# Altium project RP2040 _4 Layer_TEX(21052025).PrjPcb (part 1 of 2)
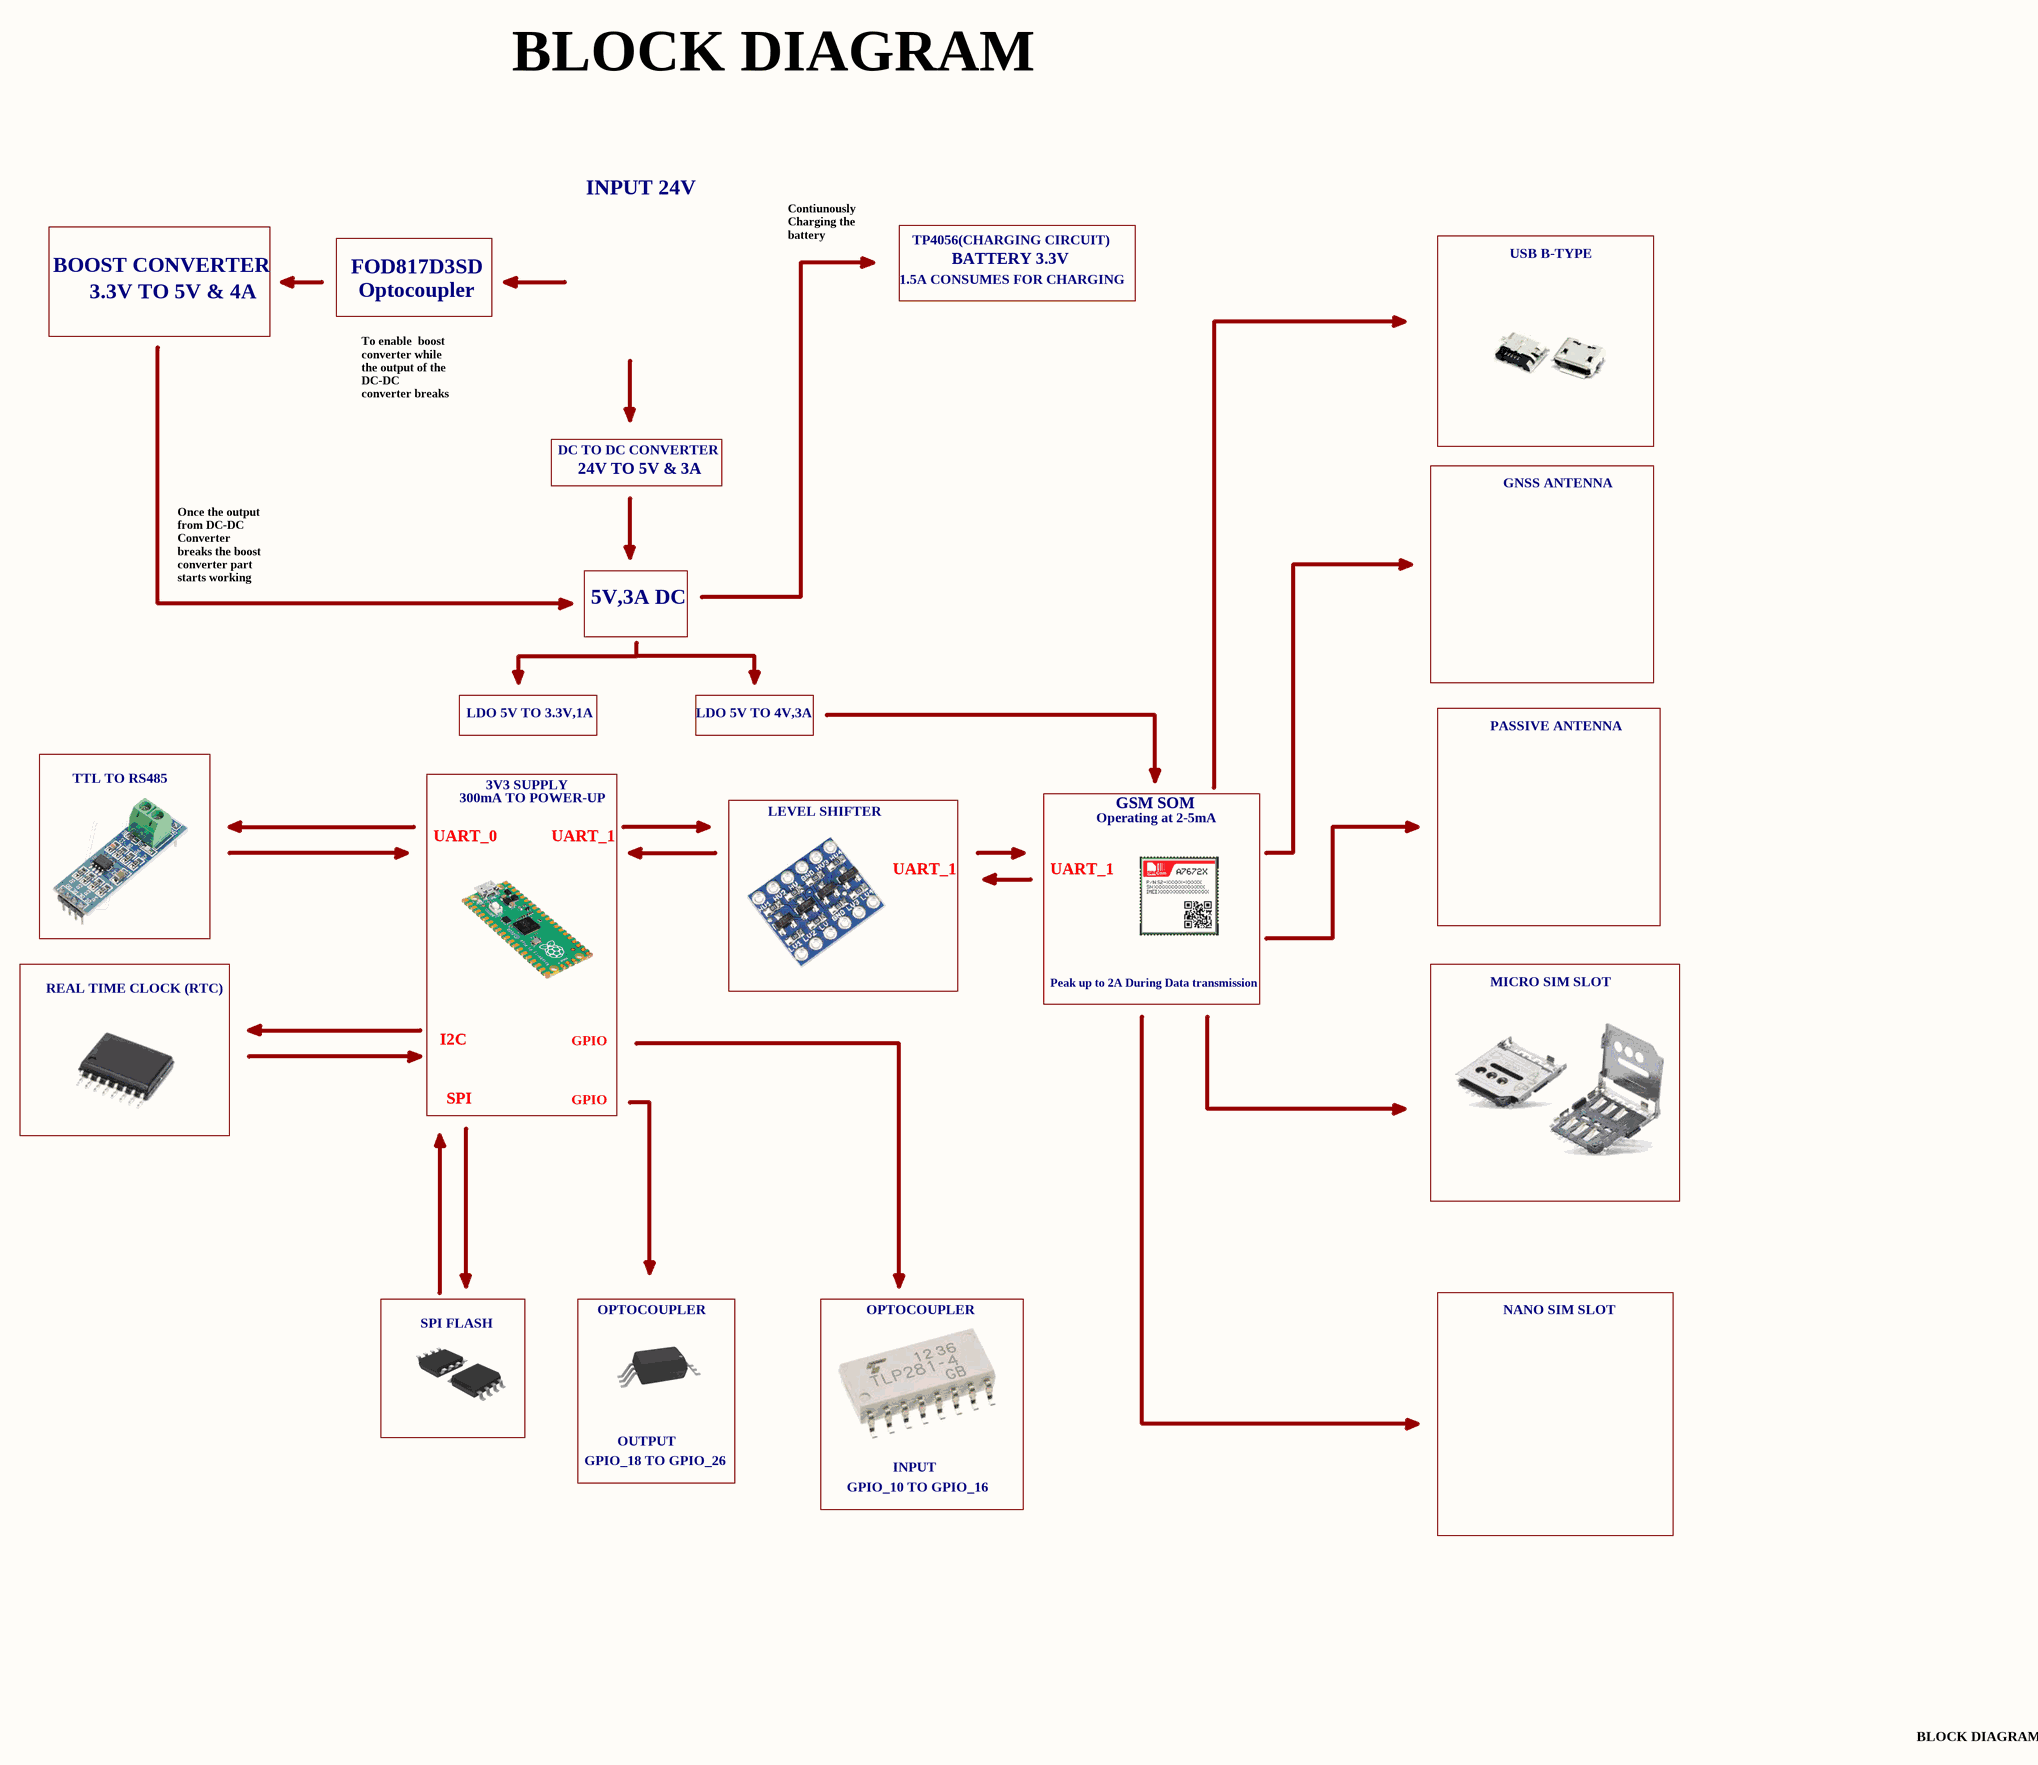
[diagram p0: Block.SchDoc]
7 sheets, 216 parts. Net scope: hierarchical (ports join the sheet entries above them; power ports are global).
Board file: RP2040_GSM.PcbDoc
Sheets:
  Block.SchDoc
  GSM Module.SchDoc
  BLOCK DIAGRAM.SchDoc
    Designator = Raspberry PI.SchDoc
    Designator = Optocoupler.SchDoc
    Designator = Power circuit.SchDoc
    Designator = GSM_SOM.SchDoc

## Sheet Block.SchDoc
size A2; SheetNumber: 1; SheetTotal: 7

### Notes on the sheet
- BLOCK DIAGRAM
- INPUT 24V
- Contiunously Charging the battery
- TP4056(CHARGING CIRCUIT)
- USB B-TYPE
- BOOST CONVERTER
- 3.3V TO 5V & 4A
- FOD817D3SD
- Optocoupler
- 1.5A CONSUMES FOR CHARGING
- BATTERY 3.3V
- To enable  boost converter while the output of the DC-DC converter breaks
- DC TO DC CONVERTER
- 24V TO 5V & 3A
- GNSS ANTENNA
- Once the output from DC-DC Converter breaks the boost converter part starts working
- 5V,3A DC
- LDO 5V TO 3.3V,1A
- LDO 5V TO 4V,3A
- TTL TO RS485
- PASSIVE ANTENNA
- UART_0
- 300mA TO POWER-UP
- 3V3 SUPPLY
- UART_1
- LEVEL SHIFTER
- Operating at 2-5mA
- GSM SOM
- Peak up to 2A During Data transmission
- MICRO SIM SLOT
- REAL TIME CLOCK (RTC)
- I2C
- GPIO
- SPI
- SPI FLASH
- OPTOCOUPLER
- NANO SIM SLOT
- GPIO_18 TO GPIO_26
- OUTPUT
- GPIO_10 TO GPIO_16
- INPUT

## Sheet GSM Module.SchDoc
size A3; SheetNumber: 2; SheetTotal: 6
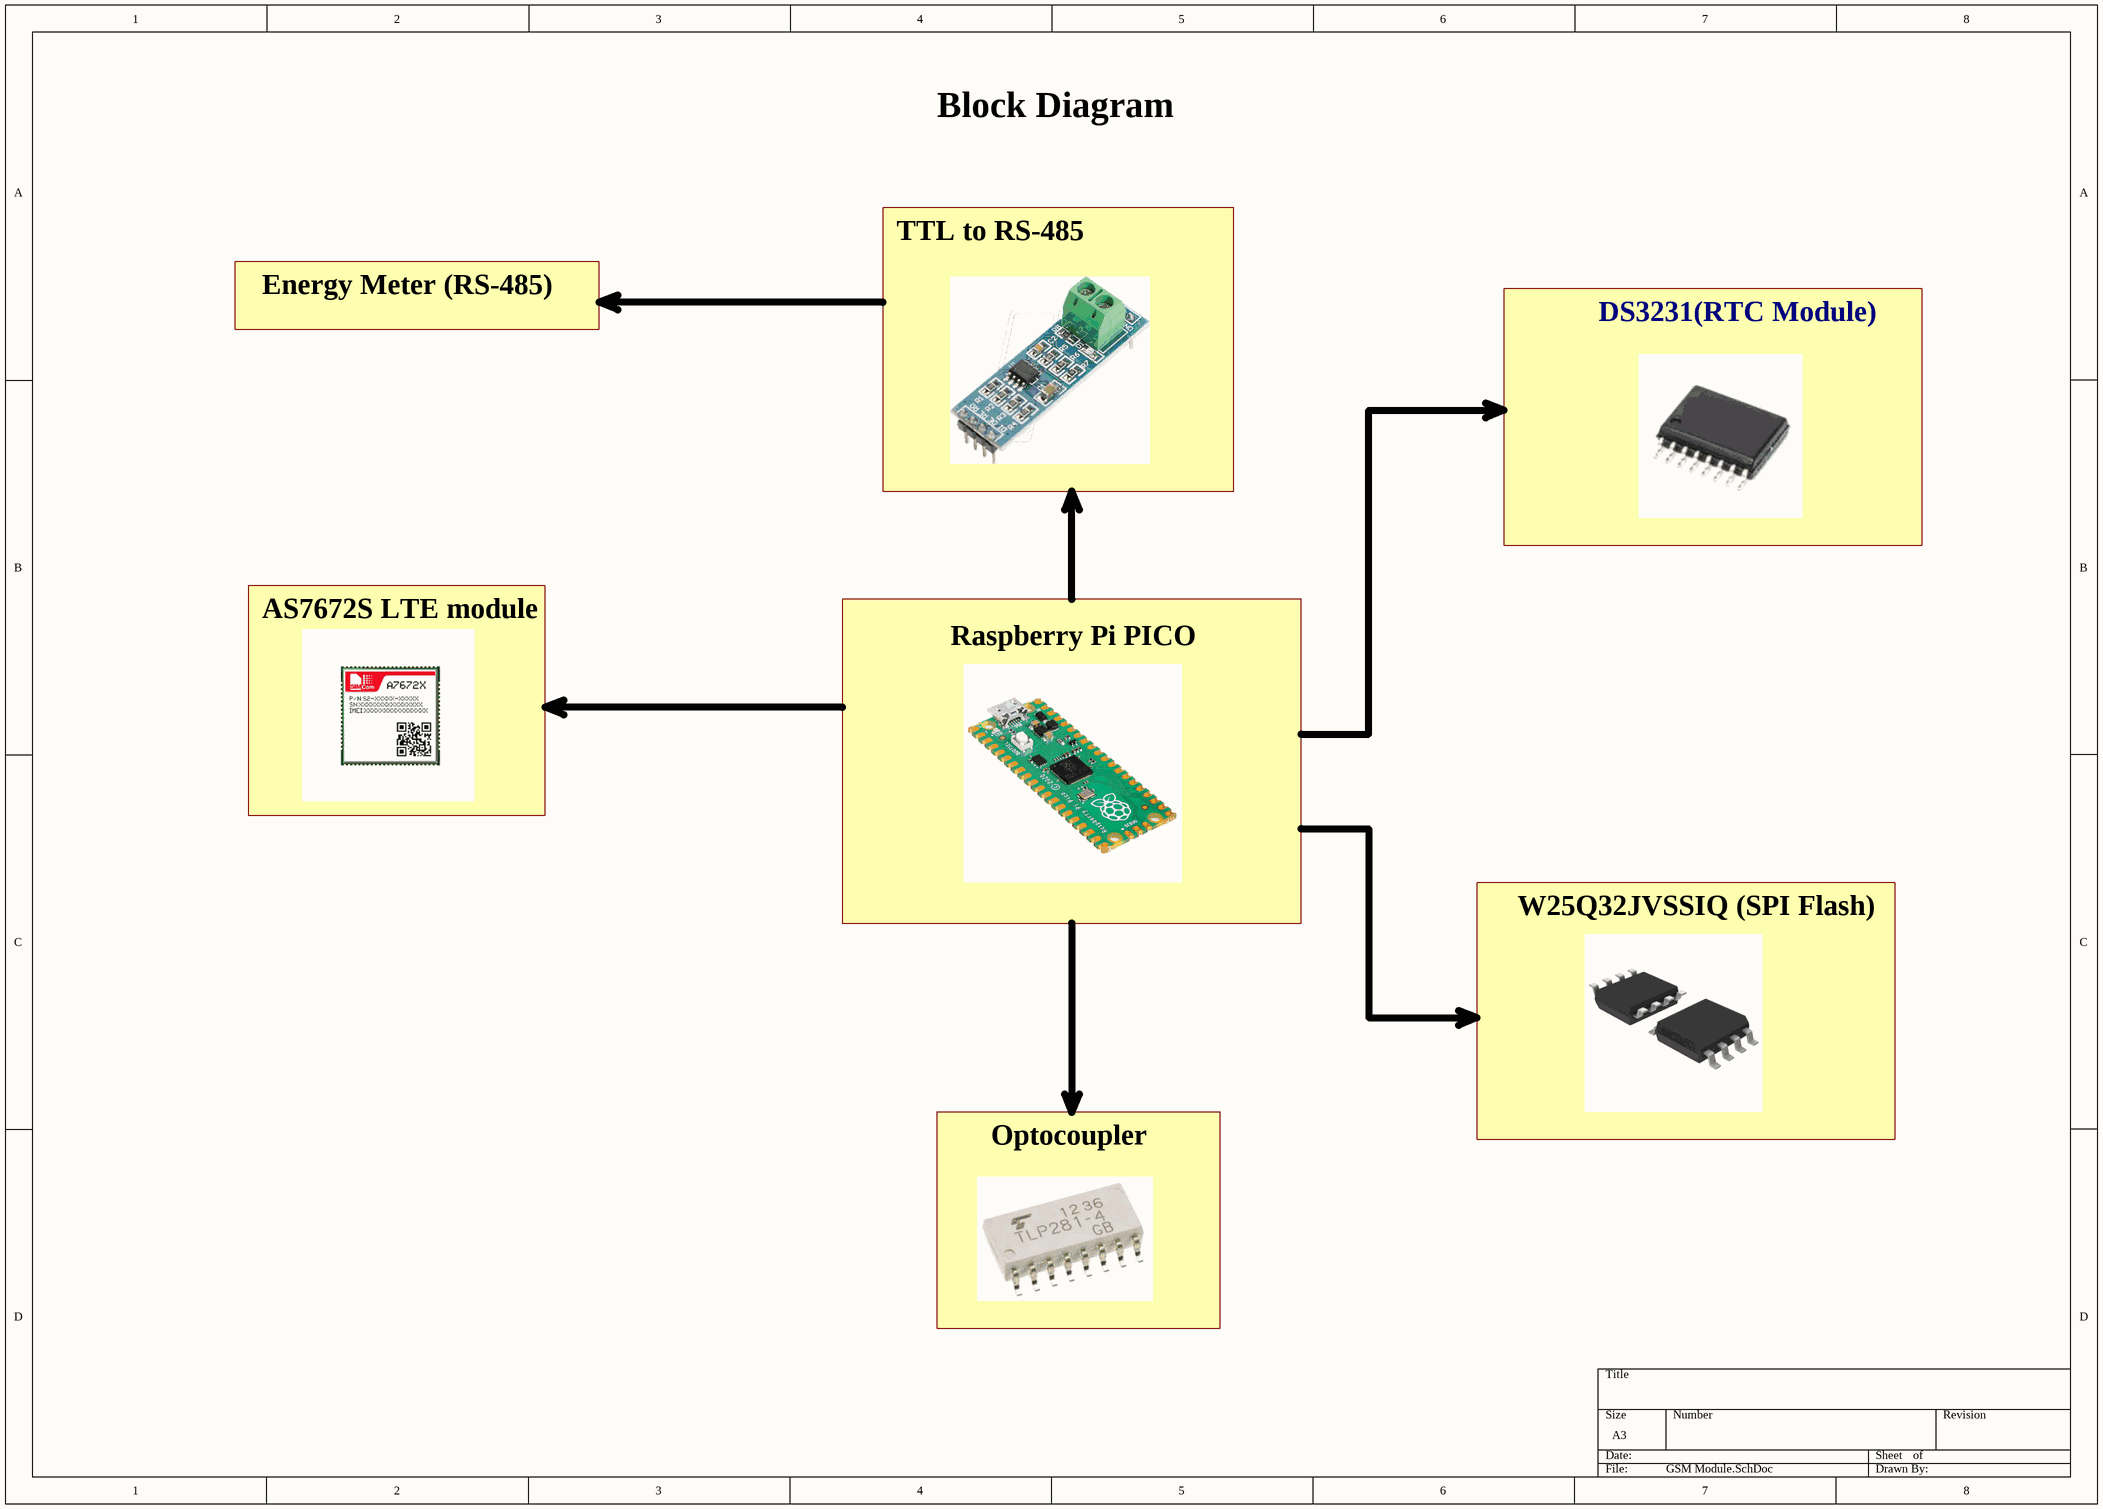
[diagram p1: GSM Module.SchDoc]

### Notes on the sheet
- Block Diagram
- TTL to RS-485
- Energy Meter (RS-485)
- DS3231(RTC Module)
- AS7672S LTE module
- Raspberry Pi PICO
- W25Q32JVSSIQ (SPI Flash)
- Optocoupler

## Sheet BLOCK DIAGRAM.SchDoc
size A3; SheetNumber: 2; SheetTotal: 6
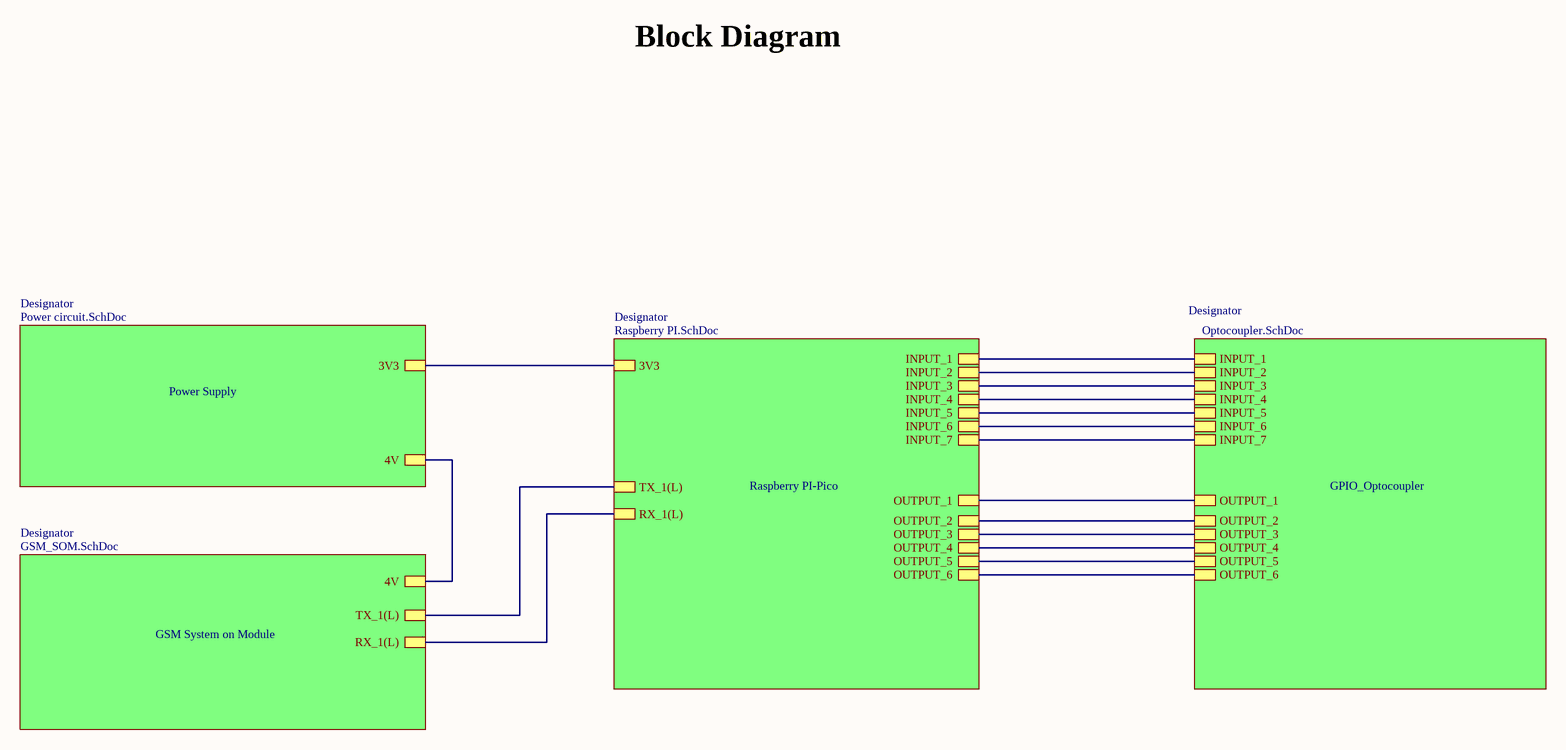
[diagram p2: BLOCK DIAGRAM.SchDoc]

### Sub-sheets
Designator = Raspberry PI.SchDoc: 3V3, INPUT_1, INPUT_2, INPUT_3, INPUT_4, INPUT_5, INPUT_6, INPUT_7, OUTPUT_1, OUTPUT_2, OUTPUT_3, OUTPUT_4, OUTPUT_5, OUTPUT_6, TX_1(L), RX_1(L)
Designator = Optocoupler.SchDoc: INPUT_1, INPUT_2, INPUT_3, INPUT_4, INPUT_5, INPUT_6, INPUT_7, OUTPUT_1, OUTPUT_2, OUTPUT_3, OUTPUT_4, OUTPUT_5, OUTPUT_6
Designator = Power circuit.SchDoc: 3V3, 4V
Designator = GSM_SOM.SchDoc: 4V, TX_1(L), RX_1(L)

### Nets
3V3: sheet Designator/3V3, sheet Designator/3V3
4V: sheet Designator/4V, sheet Designator/4V
RX_1(L): sheet Designator/RX_1(L), sheet Designator/RX_1(L)
TX_1(L): sheet Designator/TX_1(L), sheet Designator/TX_1(L)
NetQ6_10: sheet Designator/INPUT_4, sheet Designator/INPUT_4
NetQ6_12: sheet Designator/INPUT_3, sheet Designator/INPUT_3
NetQ6_14: sheet Designator/INPUT_2, sheet Designator/INPUT_2
NetQ6_16: sheet Designator/INPUT_1, sheet Designator/INPUT_1
NetQ8_12: sheet Designator/INPUT_7, sheet Designator/INPUT_7
NetQ8_14: sheet Designator/INPUT_6, sheet Designator/INPUT_6
NetQ8_16: sheet Designator/INPUT_5, sheet Designator/INPUT_5
NetR36_1: sheet Designator/OUTPUT_1, sheet Designator/OUTPUT_1
NetR39_1: sheet Designator/OUTPUT_2, sheet Designator/OUTPUT_2
NetR40_1: sheet Designator/OUTPUT_3, sheet Designator/OUTPUT_3
NetR41_1: sheet Designator/OUTPUT_4, sheet Designator/OUTPUT_4
NetR42_1: sheet Designator/OUTPUT_5, sheet Designator/OUTPUT_5
NetR45_1: sheet Designator/OUTPUT_6, sheet Designator/OUTPUT_6

### Notes on the sheet
- Block Diagram
- Power Supply
- Raspberry PI-Pico
- GPIO_Optocoupler
- GSM System on Module

## Sheet Raspberry PI.SchDoc
size A3; SheetNumber: 5; SheetTotal: 7
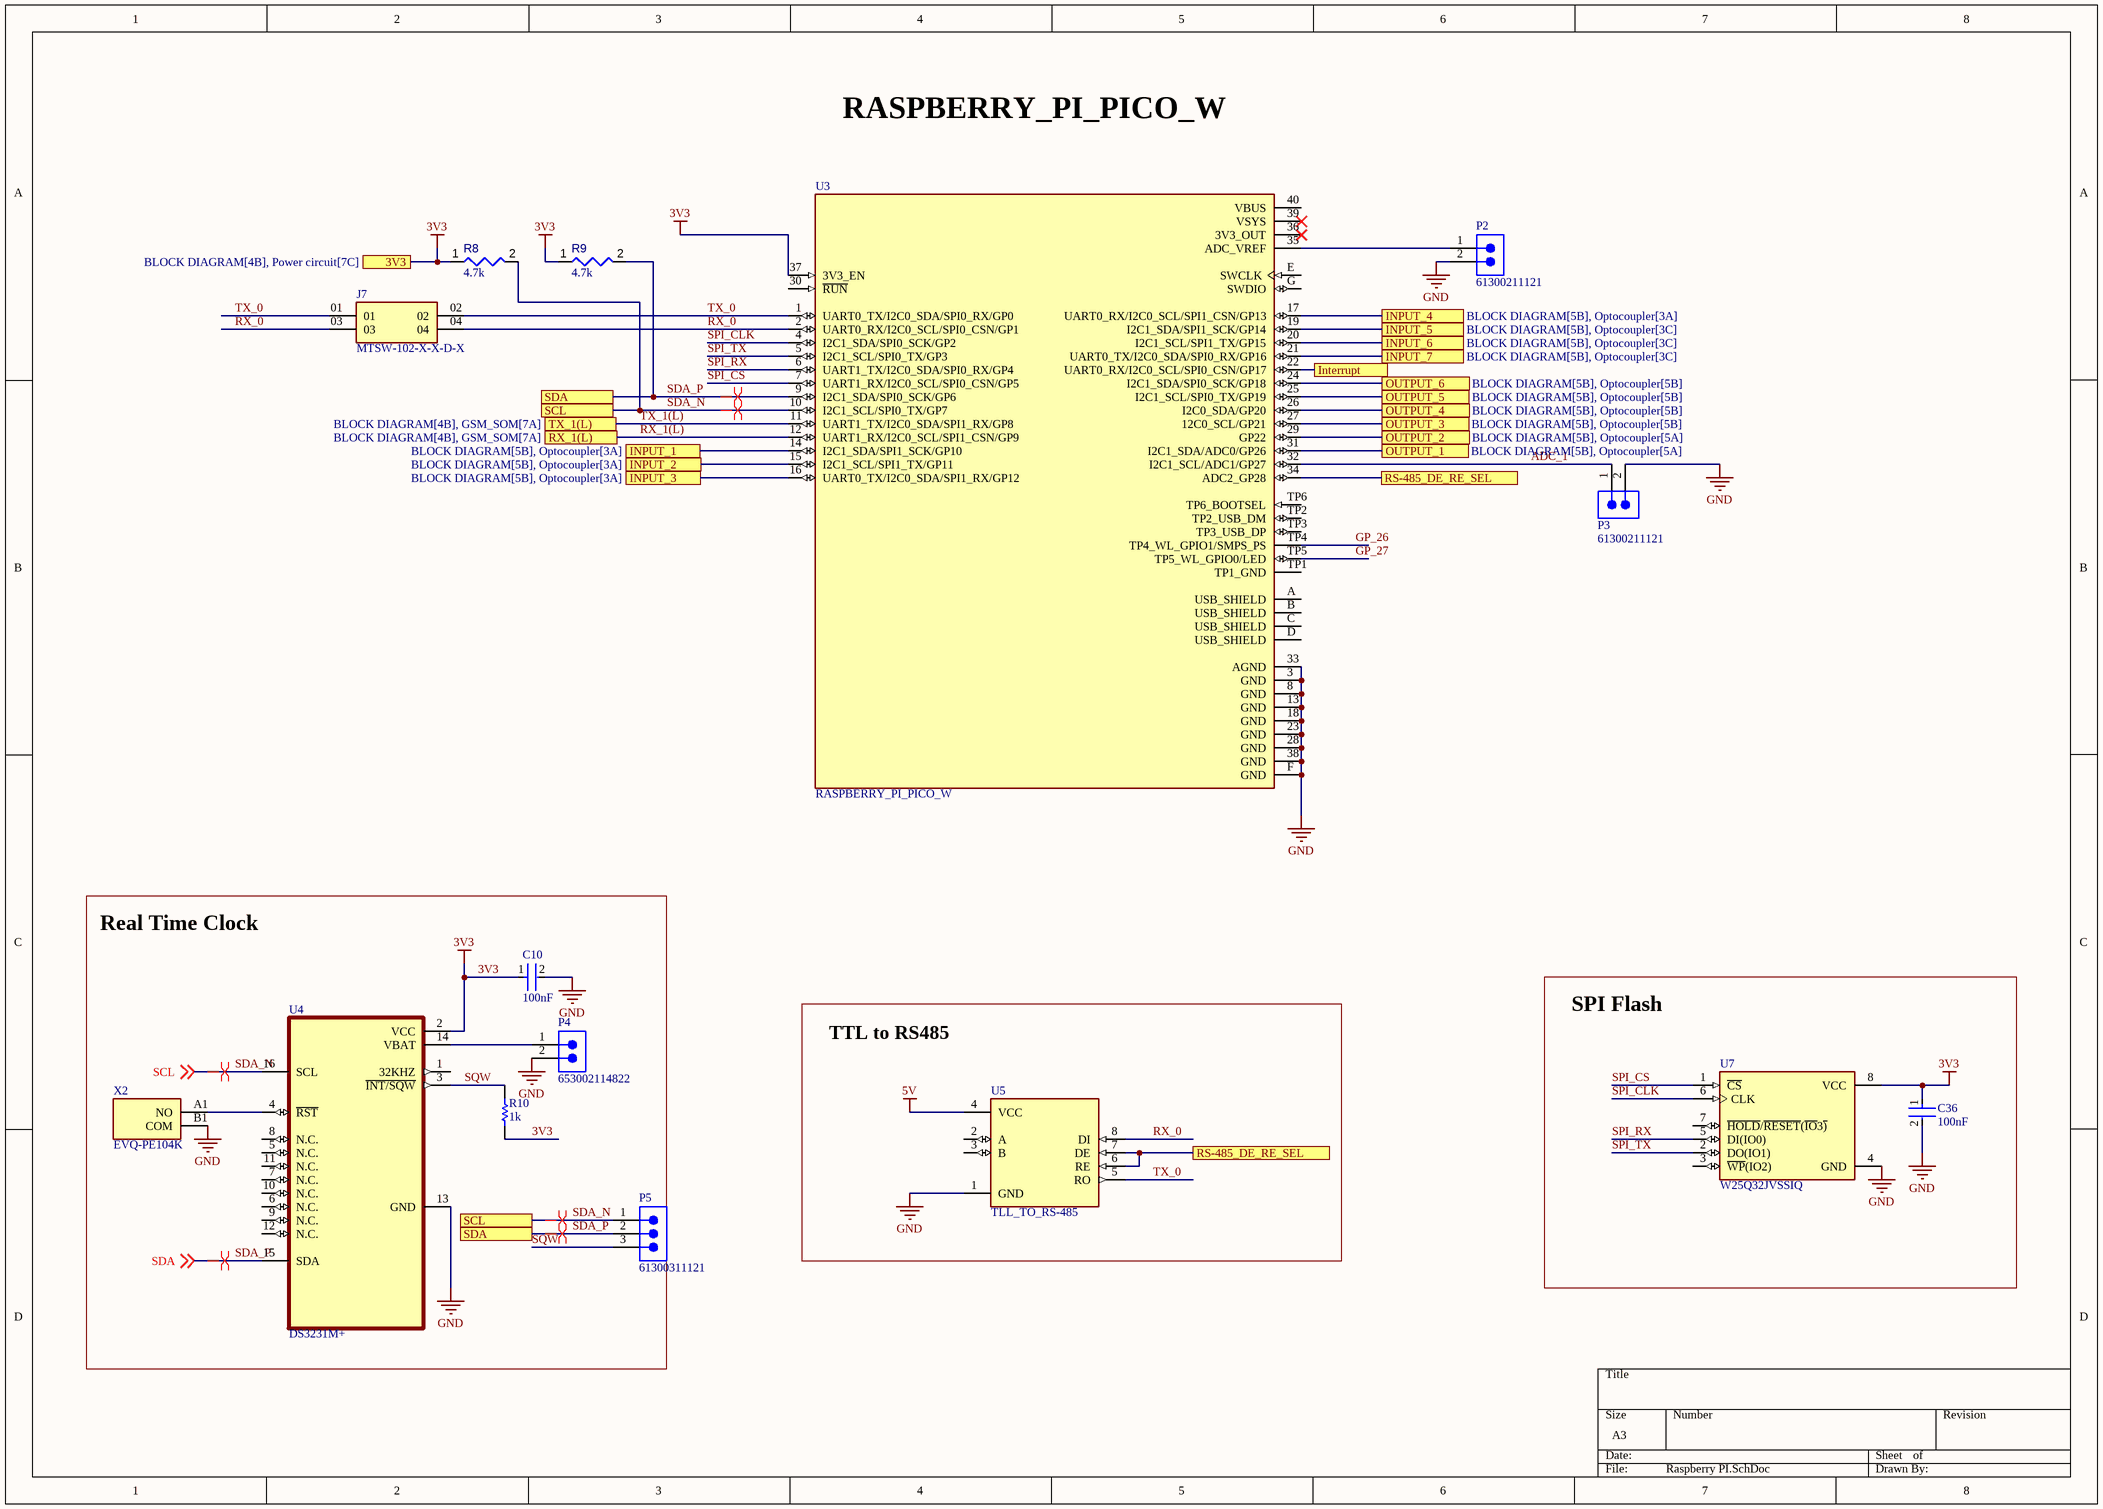
[diagram p3: Raspberry PI.SchDoc]

### Parts
C10  100nF  [FP-C0402-BB-MFG]
C36  100nF  [FP-C0402-BB-MFG]
J7  MTSW-102-X-X-D-X  [SAMTEC_MTSW-102-X-X-D-X]
P2  61300211121  [61300211121]
P3  61300211121  [61300211121]
P4  653002114822  [653002114822]
P5  61300311121  [61300311121]
R8  value 4.7k  [RESC1005X40X25ML05T05]  (hidden comment: Resistor 4k7 +/-1% 0402 100 mW)
R9  value 4.7k  [RESC1005X40X25ML05T05]  (hidden comment: Resistor 4k7 +/-1% 0402 100 mW)
R10  value 1k  [RESC1005X40X25ML05T05]  (hidden comment: Resistor 1k +/-1% 0402 100 mW)
U3  RASPBERRY_PI_PICO_W  [MODULE_RASPBERRY_PI_PICO_W]
U4  DS3231M+  [SOIC127P1032X265-16N]
U5  TLL_TO_RS-485  [MODULE_MAX485_MODULE_5V_LOGIC_TLL_TO_RS-485_CONVERTER]
U7  W25Q32JVSSIQ  [SOIC127P790X216-8N]
X2  EVQ-PE104K  [EVQPE104K]

### Blocks framed on the sheet
Real Time Clock: C10 P4 P5 R10 U4 X2
SPI Flash: C36 U7
TTL to RS485: U5

### Ports
3V3 (see BLOCK DIAGRAM[4B], Power circuit[7C]), INPUT_1 (see BLOCK DIAGRAM[5B], Optocoupler[3A]), INPUT_2 (see BLOCK DIAGRAM[5B], Optocoupler[3A]), INPUT_3 (see BLOCK DIAGRAM[5B], Optocoupler[3A]), INPUT_4 (see BLOCK DIAGRAM[5B], Optocoupler[3A]), INPUT_5 (see BLOCK DIAGRAM[5B], Optocoupler[3C]), INPUT_6 (see BLOCK DIAGRAM[5B], Optocoupler[3C]), INPUT_7 (see BLOCK DIAGRAM[5B], Optocoupler[3C]), Interrupt, OUTPUT_1 (see BLOCK DIAGRAM[5B], Optocoupler[5A]), OUTPUT_2 (see BLOCK DIAGRAM[5B], Optocoupler[5A]), OUTPUT_3 (see BLOCK DIAGRAM[5B], Optocoupler[5B]), OUTPUT_4 (see BLOCK DIAGRAM[5B], Optocoupler[5B]), OUTPUT_5 (see BLOCK DIAGRAM[5B], Optocoupler[5B]), OUTPUT_6 (see BLOCK DIAGRAM[5B], Optocoupler[5B]), RS-485_DE_RE_SEL, RX_1(L) (see BLOCK DIAGRAM[4B], GSM_SOM[7A]), SCL, SDA, TX_1(L) (see BLOCK DIAGRAM[4B], GSM_SOM[7A])

### Nets
3V3: C10.1 C36.1 R8.1 R9.1 R10.2 U3.37(3V3_EN) U4.2(VCC) U7.8(VCC) ; port 3V3
5V: U5.4(VCC)
GND: C10.2 C36.2 P2.2 P3.2 P4.2 U3.3(GND) U3.8(GND) U3.13(GND) U3.18(GND) U3.23(GND) U3.28(GND) U3.33(AGND) U3.38(GND) U3.F(GND) U4.13(GND) U5.1(GND) U7.4(GND) X2.B1(COM)
ADC_1: P3.1 U3.32(I2C1_SCL/ADC1/GP27)  [project net ADC_1_5]
GP_26: U3.TP4(TP4_WL_GPIO1/SMPS_PS)  [project net GP_26_5]
GP_27: U3.TP5(TP5_WL_GPIO0/LED)  [project net GP_27_5]
RX_0: J7.03 J7.04 U3.2(UART0_RX/I2C0_SCL/SPI0_CSN/GP1) U5.8(DI)  [project net RX_0_5]
RX_1(L): U3.12(UART1_RX/I2C0_SCL/SPI1_CSN/GP9) ; port RX_1(L)
SDA_N: P5.1 R8.2 U3.10(I2C1_SCL/SPI0_TX/GP7) U4.16(SCL) ; off-sheet SCL, port SCL  [also labelled SCL]
SDA_P: P5.2 R9.2 U3.9(I2C1_SDA/SPI0_SCK/GP6) U4.15(SDA) ; off-sheet SDA, port SDA  [also labelled SDA]
SPI_CLK: U3.4(I2C1_SDA/SPI0_SCK/GP2) U7.6(CLK)  [project net SPI_CLK_5]
SPI_CS: U3.7(UART1_RX/I2C0_SCL/SPI0_CSN/GP5) U7.1(~{CS})  [project net SPI_CS_5]
SPI_RX: U3.6(UART1_TX/I2C0_SDA/SPI0_RX/GP4) U7.5(DI(IO0))  [project net SPI_RX_5]
SPI_TX: U3.5(I2C1_SCL/SPI0_TX/GP3) U7.2(DO(IO1))  [project net SPI_TX_5]
SQW: P5.3 R10.1 U4.3(~{INT/SQW})  [project net SQW_5]
TX_0: J7.01 J7.02 U3.1(UART0_TX/I2C0_SDA/SPI0_RX/GP0) U5.5(RO)  [project net TX_0_5]
TX_1(L): U3.11(UART1_TX/I2C0_SDA/SPI1_RX/GP8) ; port TX_1(L)
NetP2_1: P2.1 U3.35(ADC_VREF)
NetP4_1: P4.1 U4.14(VBAT)
NetQ6_10: U3.17(UART0_RX/I2C0_SCL/SPI1_CSN/GP13) ; port INPUT_4
NetQ6_12: U3.16(UART0_TX/I2C0_SDA/SPI1_RX/GP12) ; port INPUT_3
NetQ6_14: U3.15(I2C1_SCL/SPI1_TX/GP11) ; port INPUT_2
NetQ6_16: U3.14(I2C1_SDA/SPI1_SCK/GP10) ; port INPUT_1
NetQ8_12: U3.21(UART0_TX/I2C0_SDA/SPI0_RX/GP16) ; port INPUT_7
NetQ8_14: U3.20(I2C1_SCL/SPI1_TX/GP15) ; port INPUT_6
NetQ8_16: U3.19(I2C1_SDA/SPI1_SCK/GP14) ; port INPUT_5
NetR36_1: U3.31(I2C1_SDA/ADC0/GP26) ; port OUTPUT_1
NetR39_1: U3.29(GP22) ; port OUTPUT_2
NetR40_1: U3.27(12C0_SCL/GP21) ; port OUTPUT_3
NetR41_1: U3.26(I2C0_SDA/GP20) ; port OUTPUT_4
NetR42_1: U3.25(I2C1_SCL/SPI0_TX/GP19) ; port OUTPUT_5
NetR45_1: U3.24(I2C1_SDA/SPI0_SCK/GP18) ; port OUTPUT_6
NetU3_22: U3.22(UART0_RX/I2C0_SCL/SPI0_CSN/GP17) ; port Interrupt
NetU3_34: U3.34(ADC2_GP28) U5.6(RE) U5.7(DE) ; port RS-485_DE_RE_SEL
NetU4_4: U4.4(~{RST}) X2.A1(NO)

Not connected (* = marked no-connect by the designer): U3 30(~{RUN}) 36(3V3_OUT)* 39(VSYS)* 40(VBUS) A(USB_SHIELD) B(USB_SHIELD) C(USB_SHIELD) D(USB_SHIELD) E(SWCLK) G(SWDIO) TP1(TP1_GND) TP2(TP2_USB_DM) TP3(TP3_USB_DP) TP6(TP6_BOOTSEL); U4 1(32KHZ) 5(N.C.) 6(N.C.) 7(N.C.) 8(N.C.) 9(N.C.) 10(N.C.) 11(N.C.) 12(N.C.); U5 2(A) 3(B); U7 3(~{WP}(IO2)) 7(~{HOLD}/~{RESET}(~{IO}3~{)})

### Layout directives
differential pair: SDA_N, SDA_P

### Notes on the sheet
- RASPBERRY_PI_PICO_W

### Library data of the parts
C10 C36 = CMP-2008-02046-2: CAP CER 0.1UF 10V X5R 0402; Manufacturer: Kemet; Manufacturer Part Number: C0402C104K8PACTU; Material: Ceramic; Capacitance: 0.10 μF; Temperature Coefficient: 15%; Tolerance: 0.1; Value: 0.10 μF; Package: C0402-BB; Temperature: -55°C to +125°C; ComponentLink2Description: Datasheet; Temperature Characteristic: X5R; Device Class L1: Passive Components; Height: 0.55mm; Lead Free: Yes; ComponentLink2URL: https://content.kemet.com/datasheets/KEM_C1002_X7R_SMD.pdf; Device Class L2: Capacitors; Temperature Range Low: -55°C; Temperature Range High: +125°C; RoHS: TRUE; Octopart: https://octopart.com/c0402c104k8pactu-kemet-140039; Automotive: No; Mouser Description: Capacitor 100 nF 10 VDC 0402; Category: Cap; Voltage Rating: 10 V; Digikey Description: CAP CER 0.1UF 10V X5R 0402; Ipc Land Pattern Name: CAPC10050X50; Device Class L3: Ceramic Capacitors
J7 = MTSW-102-X-X-D-X: MF: Samtec; Package: None; Price: None; Value: *; MP: MTSW-102-X-X-D-X; Availability: Unavailable
P2 P3 = CMP-1712-00002-6: NexarPartId: 20081794; Number of Contacts: 2; Pitch: 2.54mm; Connector Type: Male Pin; Voltage Rating: 250V; Current Rating: 3A; Gender: Male; Contact Resistance: 20mΩ; Height: 8.94mm; Lead Free: Lead Free; Number of Pins: 2; Termination: Through Hole; RoHS: Compliant; Lead Pitch: 2.54mm; REACH SVHC: No SVHC; Housing Material: PBT; Contact Mating Length: 5.9944mm; Min Operating Temperature: -40°C; Orientation: Vertical; Contact Material: Copper; Contact Gender: Male; Max Operating Temperature: 125°C; Number of Rows: 1; Number of Positions: 2; Packaging: Bulk; Contact Plating: Gold; Mount: Through Hole; Color: Black; Operating Supply Voltage: 250V
P4 = CMP-1502-00739-2: NexarPartId: 116856437; Insulation Resistance: 100MΩ; Current Rating: 1A; Pitch: 1.25mm; Gender: Male; Number of Pins: 2; Min Operating Temperature: -40°C; Length: 4.25mm; Max Operating Temperature: 85°C; Contact Plating: Tin; RoHS: Compliant
P5 = CMP-1502-01062-3: NexarPartId: 32855521; Current Rating: 3A; Voltage Rating: 250V; Number of Positions: 3; Pitch: 2.54mm; Contact Resistance: 20mΩ; Connector Type: Male Pin; Gender: Male; REACH SVHC: Unknown; Packaging: Bulk; Contact Material: Copper; Min Operating Temperature: -40°C; Number of Rows: 1; Orientation: Vertical; RoHS: Compliant; Contact Plating: Gold; Max Operating Temperature: 105°C; Mount: Through Hole; Height: 8.94mm; Operating Supply Voltage: 250V; Number of Pins: 3; Contact Mating Length: 5.9944mm; Number of Contacts: 3; Color: Black; Lead Free: Lead Free; Lead Pitch: 2.54mm; Termination: Solder
R8 R9 = CMP-009-00030-5: Chip Resistor, 4.7 KOhm, +/- 1%, 0.1 W, -55 to 155 degC, 0402 (1005 Metric); Power: 100mW; Voltage Rating: 50V; Mounting Technology: SM; RoHS Compliant: True; Tolerance: 1%; Min Operating Temperature: -55°C; Max Operating Temperature: 155°C; Case/Package: 0402; Pins: 2
R10 = CMP-009-00009-5: Chip Resistor, 1 KOhm, +/- 1%, 0.1 W, -55 to 155 degC, 0402 (1005 Metric); Power: 100mW; Voltage Rating: 50V; Min Operating Temperature: -55°C; Max Operating Temperature: 155°C; RoHS Compliant: True; Mounting Technology: SM; Pins: 2; Tolerance: 1%; Case/Package: 0402
U3 = RASPBERRY_PI_PICO_W: Raspberry Pi Board, Arm Cortex-M0+; Silicon Manufacturer:Raspberry Pi; No. Of Bits:32Bit; Silicon Family Name:-; Core Architecture:Arm; Core Sub-Architecture:Cortex-M0+; Silicon Core Number:Rp2040; Product Range:Raspberry Pi Pico Rohs Compliant: Yes |Raspberry-Pi RASPBERRY PI PICO W; SnapEDA_Link: https://www.snapeda.com/parts/RASPBERRY%20PI%20PICO%20W/Raspberry+Pi/view-part/?ref=snap; Package: None; Value: *; MF: Raspberry Pi; MP: RASPBERRY PI PICO W; Check_prices: https://www.snapeda.com/parts/RASPBERRY%20PI%20PICO%20W/Raspberry+Pi/view-part/?ref=eda
U4 = DS3231M+: Real Time Clock _RTC_ IC Clock/Calendar IÂ²C, 2-Wire Serial 8-SOIC _0.154, 3.90mm Width_; MF: Maxim Integrated; Availability: Unavailable; MP: DS3231M; Price: None; Value: *; SnapEDA_Link: https://www.snapeda.com/parts/DS3231M/Maxim%20Integrated/view-part/2748210/?ref=snap; Package: SOIC-8 Maxim Integrated
U5 = MAX485_MODULE_5V_LOGIC_TLL_TO_RS-485_CONVERTER: 5V MAX485 TTL To RS485 Converter Module Board for Arduino; MP: MAX485 Module 5V logic TLL to RS-485 converter; MF: e-Gizmo Mechatronix Central; Value: *; SnapEDA_Link: https://www.snapeda.com/parts/MAX485%20Module%205V%20logic%20TLL%20to%20RS-485%20converter/e-Gizmo+Mechatronix+Central/view-part/?ref=snap; Package: Package; Availability: Not in stock; Check_prices: https://www.snapeda.com/parts/MAX485%20Module%205V%20logic%20TLL%20to%20RS-485%20converter/e-Gizmo+Mechatronix+Central/view-part/?ref=eda; Price: None
U7 = W25Q32JVSSIQ: FLASH - NOR Memory IC 32Mb (4M x 8) SPI - Quad I/O 133 MHz 8-SOIC; MF: Winbond; SnapEDA_Link: https://www.snapeda.com/parts/W25Q32JVSSIQ/Winbond+Electronics/view-part/?ref=snap; Package: SOIC-8 Winbond; Value: *; MP: W25Q32JVSSIQ; Check_prices: https://www.snapeda.com/parts/W25Q32JVSSIQ/Winbond+Electronics/view-part/?ref=eda
X2 = EVQ-PE104K: Switch Tactile N.O. SPST Rectangular Button J-Bend 0.05A 12VDC 1N SMD T/R; Manufacturer_Name: Panasonic; Geometry.Height: 4.6mm; Mouser Part Number: 667-EVQ-PE104K; Mouser Price/Stock: https://www.mouser.co.uk/ProductDetail/Panasonic/EVQ-PE104K?qs=wX5mvoJE4NGLiYsCBZAptQ%3D%3D; Manufacturer_Part_Number: EVQ-PE104K; Datasheet Link: https://industrial.panasonic.com/cdbs/www-data/pdf/ATK0000/ATK0000C376.pdf

## Sheet Optocoupler.SchDoc
size A3; SheetNumber: 6; SheetTotal: 6
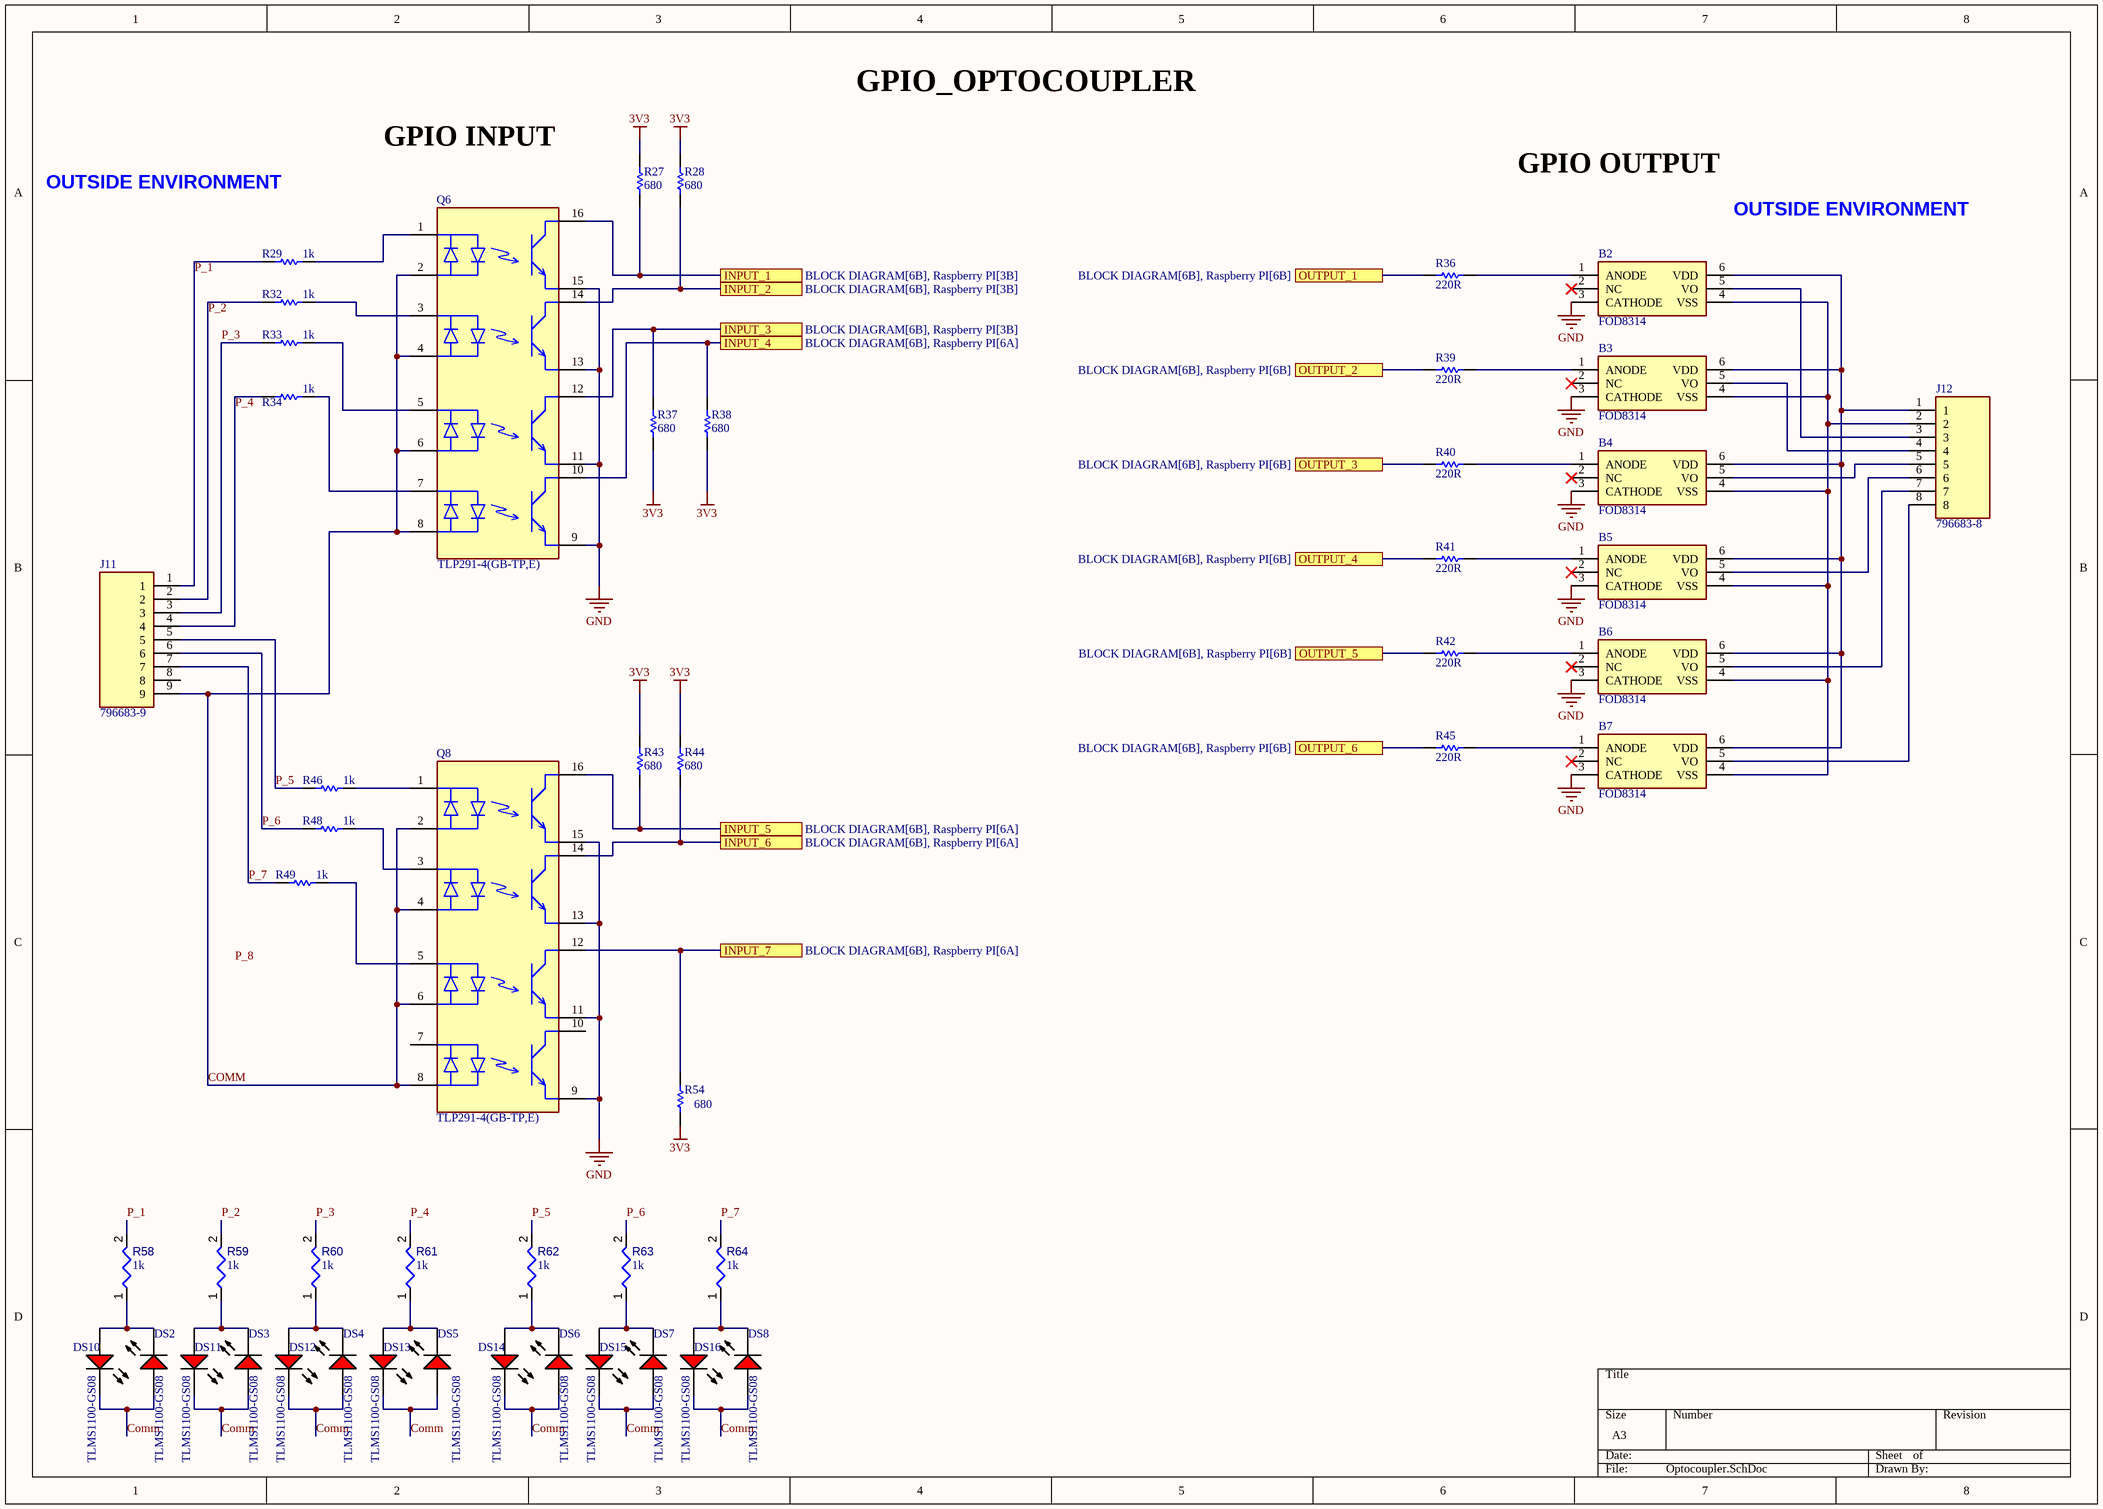
[diagram p4: Optocoupler.SchDoc]

### Parts
B2  FOD8314  [SOIC127P970X348-6N]
B3  FOD8314  [SOIC127P970X348-6N]
B4  FOD8314  [SOIC127P970X348-6N]
B5  FOD8314  [SOIC127P970X348-6N]
B6  FOD8314  [SOIC127P970X348-6N]
B7  FOD8314  [SOIC127P970X348-6N]
DS2  TLMS1100-GS08  [VISH-TLMX1100_V]
DS3  TLMS1100-GS08  [VISH-TLMX1100_V]
DS4  TLMS1100-GS08  [VISH-TLMX1100_V]
DS5  TLMS1100-GS08  [VISH-TLMX1100_V]
DS6  TLMS1100-GS08  [VISH-TLMX1100_V]
DS7  TLMS1100-GS08  [VISH-TLMX1100_V]
DS8  TLMS1100-GS08  [VISH-TLMX1100_V]
DS10  TLMS1100-GS08  [VISH-TLMX1100_V]
DS11  TLMS1100-GS08  [VISH-TLMX1100_V]
DS12  TLMS1100-GS08  [VISH-TLMX1100_V]
DS13  TLMS1100-GS08  [VISH-TLMX1100_V]
DS14  TLMS1100-GS08  [VISH-TLMX1100_V]
DS15  TLMS1100-GS08  [VISH-TLMX1100_V]
DS16  TLMS1100-GS08  [VISH-TLMX1100_V]
J11  796683-9  [TE_796683-9]
J12  796683-8  [TE_796683-8]
Q6  TLP291-4(GB-TP,E)  [FP-11-11F1-MFG]
Q8  TLP291-4(GB-TP,E)  [FP-11-11F1-MFG]
R27  value 680  [RESC3216X60X45ML15T20]  (hidden comment: RC1206JR-07680RL)
R28  value 680  [RESC3216X60X45ML15T20]  (hidden comment: RC1206JR-07680RL)
R29  value 1k  [RESC3216X60X45ML15T20]  (hidden comment: RC1206FR-071KL)
R32  value 1k  [RESC3216X60X45ML15T20]  (hidden comment: RC1206FR-071KL)
R33  value 1k  [RESC3216X60X45ML15T20]  (hidden comment: RC1206FR-071KL)
R34  value 1k  [RESC3216X60X45ML15T20]  (hidden comment: RC1206FR-071KL)
R36  220R  [RESC1608X55X25ML10T15]
R37  value 680  [RESC3216X60X45ML15T20]  (hidden comment: RC1206JR-07680RL)
R38  value 680  [RESC3216X60X45ML15T20]  (hidden comment: RC1206JR-07680RL)
R39  220R  [RESC1608X55X25ML10T15]
R40  220R  [RESC1608X55X25ML10T15]
R41  220R  [RESC1608X55X25ML10T15]
R42  220R  [RESC1608X55X25ML10T15]
R43  value 680  [RESC3216X60X45ML15T20]  (hidden comment: RC1206JR-07680RL)
R44  value 680  [RESC3216X60X45ML15T20]  (hidden comment: RC1206JR-07680RL)
R45  220R  [RESC1608X55X25ML10T15]
R46  value 1k  [RESC3216X60X45ML15T20]  (hidden comment: RC1206FR-071KL)
R48  value 1k  [RESC3216X60X45ML15T20]  (hidden comment: RC1206FR-071KL)
R49  value 1k  [RESC3216X60X45ML15T20]  (hidden comment: RC1206FR-071KL)
R54  value 680  [RESC3216X60X45ML15T20]  (hidden comment: RC1206JR-07680RL)
R58  value 1k  [RESC1608X55X25ML10T15]  (hidden comment: Resistor 1k +/-1% 0603 100 mW)
R59  value 1k  [RESC1608X55X25ML10T15]  (hidden comment: Resistor 1k +/-1% 0603 100 mW)
R60  value 1k  [RESC1608X55X25ML10T15]  (hidden comment: Resistor 1k +/-1% 0603 100 mW)
R61  value 1k  [RESC1608X55X25ML10T15]  (hidden comment: Resistor 1k +/-1% 0603 100 mW)
R62  value 1k  [RESC1608X55X25ML10T15]  (hidden comment: Resistor 1k +/-1% 0603 100 mW)
R63  value 1k  [RESC1608X55X25ML10T15]  (hidden comment: Resistor 1k +/-1% 0603 100 mW)
R64  value 1k  [RESC1608X55X25ML10T15]  (hidden comment: Resistor 1k +/-1% 0603 100 mW)

### Ports
INPUT_1 (see BLOCK DIAGRAM[6B], Raspberry PI[3B]), INPUT_2 (see BLOCK DIAGRAM[6B], Raspberry PI[3B]), INPUT_3 (see BLOCK DIAGRAM[6B], Raspberry PI[3B]), INPUT_4 (see BLOCK DIAGRAM[6B], Raspberry PI[6A]), INPUT_5 (see BLOCK DIAGRAM[6B], Raspberry PI[6A]), INPUT_6 (see BLOCK DIAGRAM[6B], Raspberry PI[6A]), INPUT_7 (see BLOCK DIAGRAM[6B], Raspberry PI[6A]), OUTPUT_1 (see BLOCK DIAGRAM[6B], Raspberry PI[6B]), OUTPUT_2 (see BLOCK DIAGRAM[6B], Raspberry PI[6B]), OUTPUT_3 (see BLOCK DIAGRAM[6B], Raspberry PI[6B]), OUTPUT_4 (see BLOCK DIAGRAM[6B], Raspberry PI[6B]), OUTPUT_5 (see BLOCK DIAGRAM[6B], Raspberry PI[6B]), OUTPUT_6 (see BLOCK DIAGRAM[6B], Raspberry PI[6B])

### Nets
3V3: R27.1 R28.1 R37.2 R38.2 R43.1 R44.1 R54.2
GND: B2.3(CATHODE) B3.3(CATHODE) B4.3(CATHODE) B5.3(CATHODE) B6.3(CATHODE) B7.3(CATHODE) Q6.9(E) Q6.11(E) Q6.13(E) Q6.15(E) Q8.9(E) Q8.11(E) Q8.13(E) Q8.15(E)
COMM: DS2.1(A) DS3.1(A) DS4.1(A) DS5.1(A) DS6.1(A) DS7.1(A) DS8.1(A) DS10.2(K) DS11.2(K) DS12.2(K) DS13.2(K) DS14.2(K) DS15.2(K) DS16.2(K) J11.9 Q6.2(1_Anode/Cathode) Q6.4(2_Anode/Cathode) Q6.6(3_Anode/Cathode) Q6.8(4_Anode/Cathode) Q8.2(1_Anode/Cathode) Q8.4(2_Anode/Cathode) Q8.6(3_Anode/Cathode) Q8.8(4_Anode/Cathode)  [project net COMM_6]
P_1: J11.1 R29.2 R58.2  [project net P_1_6]
P_2: J11.2 R32.2 R59.2  [project net P_2_6]
P_3: J11.3 R33.2 R60.2  [project net P_3_6]
P_4: J11.4 R34.2 R61.2  [project net P_4_6]
P_5: J11.5 R46.2 R62.2  [project net P_5_6]
P_6: J11.6 R48.2 R63.2  [project net P_6_6]
P_7: J11.7 R49.2 R64.2  [project net P_7_6]
NetB2_1: B2.1(ANODE) R36.2
NetB2_4: B2.4(VSS) B3.4(VSS) B4.4(VSS) B5.4(VSS) B6.4(VSS) B7.4(VSS) J12.2
NetB2_5: B2.5(VO) J12.3
NetB2_6: B2.6(VDD) B3.6(VDD) B4.6(VDD) B5.6(VDD) B6.6(VDD) B7.6(VDD) J12.1
NetB3_1: B3.1(ANODE) R39.2
NetB3_5: B3.5(VO) J12.4
NetB4_1: B4.1(ANODE) R40.2
NetB4_5: B4.5(VO) J12.5
NetB5_1: B5.1(ANODE) R41.2
NetB5_5: B5.5(VO) J12.6
NetB6_1: B6.1(ANODE) R42.2
NetB6_5: B6.5(VO) J12.7
NetB7_1: B7.1(ANODE) R45.2
NetB7_5: B7.5(VO) J12.8
NetDS2_2: DS2.2(K) DS10.1(A) R58.1
NetDS3_2: DS3.2(K) DS11.1(A) R59.1
NetDS4_2: DS4.2(K) DS12.1(A) R60.1
NetDS5_2: DS5.2(K) DS13.1(A) R61.1
NetDS6_2: DS6.2(K) DS14.1(A) R62.1
NetDS7_2: DS7.2(K) DS15.1(A) R63.1
NetDS8_2: DS8.2(K) DS16.1(A) R64.1
NetQ6_1: Q6.1(1_Cathode/Anode) R29.1
NetQ6_3: Q6.3(2_Cathode/Anode) R32.1
NetQ6_5: Q6.5(3_Cathode/Anode) R33.1
NetQ6_7: Q6.7(4_Cathode/Anode) R34.1
NetQ6_10: Q6.10(C) R38.1 ; port INPUT_4
NetQ6_12: Q6.12(C) R37.1 ; port INPUT_3
NetQ6_14: Q6.14(C) R28.2 ; port INPUT_2
NetQ6_16: Q6.16(C) R27.2 ; port INPUT_1
NetQ8_1: Q8.1(1_Cathode/Anode) R46.1
NetQ8_3: Q8.3(2_Cathode/Anode) R48.1
NetQ8_5: Q8.5(3_Cathode/Anode) R49.1
NetQ8_12: Q8.12(C) R54.1 ; port INPUT_7
NetQ8_14: Q8.14(C) R44.2 ; port INPUT_6
NetQ8_16: Q8.16(C) R43.2 ; port INPUT_5
NetR36_1: R36.1 ; port OUTPUT_1
NetR39_1: R39.1 ; port OUTPUT_2
NetR40_1: R40.1 ; port OUTPUT_3
NetR41_1: R41.1 ; port OUTPUT_4
NetR42_1: R42.1 ; port OUTPUT_5
NetR45_1: R45.1 ; port OUTPUT_6

Not connected (* = marked no-connect by the designer): B2 2(NC)*; B3 2(NC)*; B4 2(NC)*; B5 2(NC)*; B6 2(NC)*; B7 2(NC)*; J11 8; Q8 7(4_Cathode/Anode) 10(C)

### Notes on the sheet
- GPIO_OPTOCOUPLER
- GPIO INPUT
- GPIO OUTPUT
- OUTSIDE ENVIRONMENT
- Labels drawn without touching a wire or pin: P_8

### Library data of the parts
B2-B7 = FOD8314: Logic Output Optocouplers 1.0A Output Gate Driver Optocoupler; Manufacturer_Name: onsemi; Geometry.Height: 3.48mm; Manufacturer_Part_Number: FOD8314; Mouser Part Number: 512-FOD8314; Mouser Price/Stock: https://www.mouser.com/Search/Refine.aspx?Keyword=512-FOD8314; Arrow Part Number: FOD8314; Arrow Price/Stock: https://www.arrow.com/en/products/fod8314/on-semiconductor?region=nac; Datasheet Link: https://componentsearchengine.com/Datasheets/1/FOD8314.pdf
DS2-DS8 DS10-DS16 = CMP-007-00030-2: Red Led, 20mA, 2.1 V, -40 to 100 degC, 2-Pin SMD (0603), RoHS, Tape and Reel; Manufacturer: Vishay Semiconductor; Viewing Angle: 160degrees; Forward Voltage: 2.1V; Lens Style: Clear; Power: 90mW; Luminous Intensity: 63mcd; Datasheet Version: Rev. 2.7, 03/2016; Package Quantity: 3000; Colour: Red; Package Description: 2-Pin Surface Mount Device, Body 1.6 x 0.8 mm; Datasheet URL: http://www.vishay.com/docs/83173/tlmb1100.pdf; Package Reference: TLMX1100; Max Operating Temperature: 100°C; Mounting Technology: SM; Packaging: TapeandReel; Case/Package: 0603; Illumination Colour: Red; Forward Current: 20mA; Manufacturer URL: http://www.vishay.com/; RoHS Compliant: True; Min Operating Temperature: -40°C; Nominal Vf: 2.1V; Pins: 2
J11 = 796683-9: 9 Position Wire to Board Terminal Block Horizontal with Board 0.197 (5.00mm) Through Hole; MF: TE Connectivity; MP: 796683-9; DigiKey-Purchase-URL: https://snapeda.com/shop?store=DigiKey&id=2387175; Package: None; EU_RoHS_Compliance: Compliant with Exemptions; Price: None; Value: *; SnapEDA_Link: https://www.snapeda.com/parts/796683-9/TE%20Connectivity/view-part/2387175/?ref=snap; Availability: Warning; Check_prices: https://www.snapeda.com/parts/796683-9/TE%20Connectivity/view-part/2387175/?ref=eda
Q6 Q8 = CMP-35887-000006-1: OPTOISOLTR 2.5KV 4CH TRANS 16-SO; Manufacturer: Toshiba; Manufacturer Part Number: TLP290-4(TP,E; Emiiter Collector Voltage: 7V; Min Current Transfer Ratio: 50%; Forward Voltage: 1.2V; Standoff Height: 0.1mm; Turn Off Delay Time: 3us; Isolation Voltage: 2500Vrms; Forward Current: 10mA; Max Current Transfer Ratio: 400%; Max Junction Temp: +125°C; Collector Emitter Voltage: 80V; Device Class L3: unset; Octopart: https://octopart.com/tlp290-4%28tp%2Ce-toshiba-33727646; Device Class L2: Optocouplers; Digikey Description: OPTOISOLTR 2.5KV 4CH TRANS 16-SO; Height: 2.3mm; RoHS: TRUE; Mouser Description: Transistor Output Optocouplers X36 PBF Transistor Couplr ACInput 110C; Temperature: -55°C to +110°C; Temperature Range Low: -55°C; Ambient Temperature Range Low: -55°C; ComponentLink2Description: Datasheet; Ambient Temperature Range High: +110°C; Automotive: No; Device Class L1: Optoelectronics; Temperature Range High: +110°C; Footprint Url: https://toshiba.semicon-storage.com/us/design-support/package/detail.SO16.html; Turn On Delay Time: 3us; Lead Free: Yes; ComponentLink2URL: https://toshiba.semicon-storage.com/info/docget.jsp?did=12855&prodName=TLP290-4; Package: 11-11F1; Category: Trans
R27-R29 R32-R34 R37 R38 R43 R44 R46 R48 R49 R54 = CMP-009-00002-5: Chip Resistor, 0 Ohm, +/- 5%, 0.25 W, -55 to 155 degC, 1206 (3216 Metric); Voltage Rating: 200V; Power: 250mW; Tolerance: 5%; Min Operating Temperature: -55°C; Mounting Technology: SM; Max Operating Temperature: 155°C; Case/Package: 1206; RoHS Compliant: True; Pins: 2
R36 R39-R42 R45 = CMP-1659-00018-2: General Purpose Chip Resistors, 220 Ohm, +/- 1%, -55 to 155 degC, 0603 (1608 Metric), RoHS, Tape and Reel; RoHSCompliant: false; DatasheetVersion: Rev. 4, 04/2009; ComponentLink2Description: Datasheet; ComponentLink2URL: https://datasheet.ciiva.com/11808/0900766b80f96399-11808136.pdf; ComponentLink1URL: http://www.yageo.com/; ComponentLink1Description: Manufacturer URL; PackageReference: 0603; PackageDescription: 2-Pin Surface Mount Device, Body 1.6 x 0.8 mm
R58-R64 = CMP-009-00014-5: Chip Resistor, 1 KOhm, +/-1%, 0.1 W, -55 to 155 degC, 0603 (1608 Metric); Voltage Rating: 50V; Power: 100mW; Tolerance: 1%; Mounting Technology: SM; Pins: 2; Case/Package: 0603; Min Operating Temperature: -55°C; RoHS Compliant: True; Max Operating Temperature: 155°C
J12 = 796683-8: Package: None; Price: None; Value: *; MP: 796683-8; Availability: Unavailable

## Sheet Power circuit.SchDoc
size A3; SheetNumber: 4; SheetTotal: 7
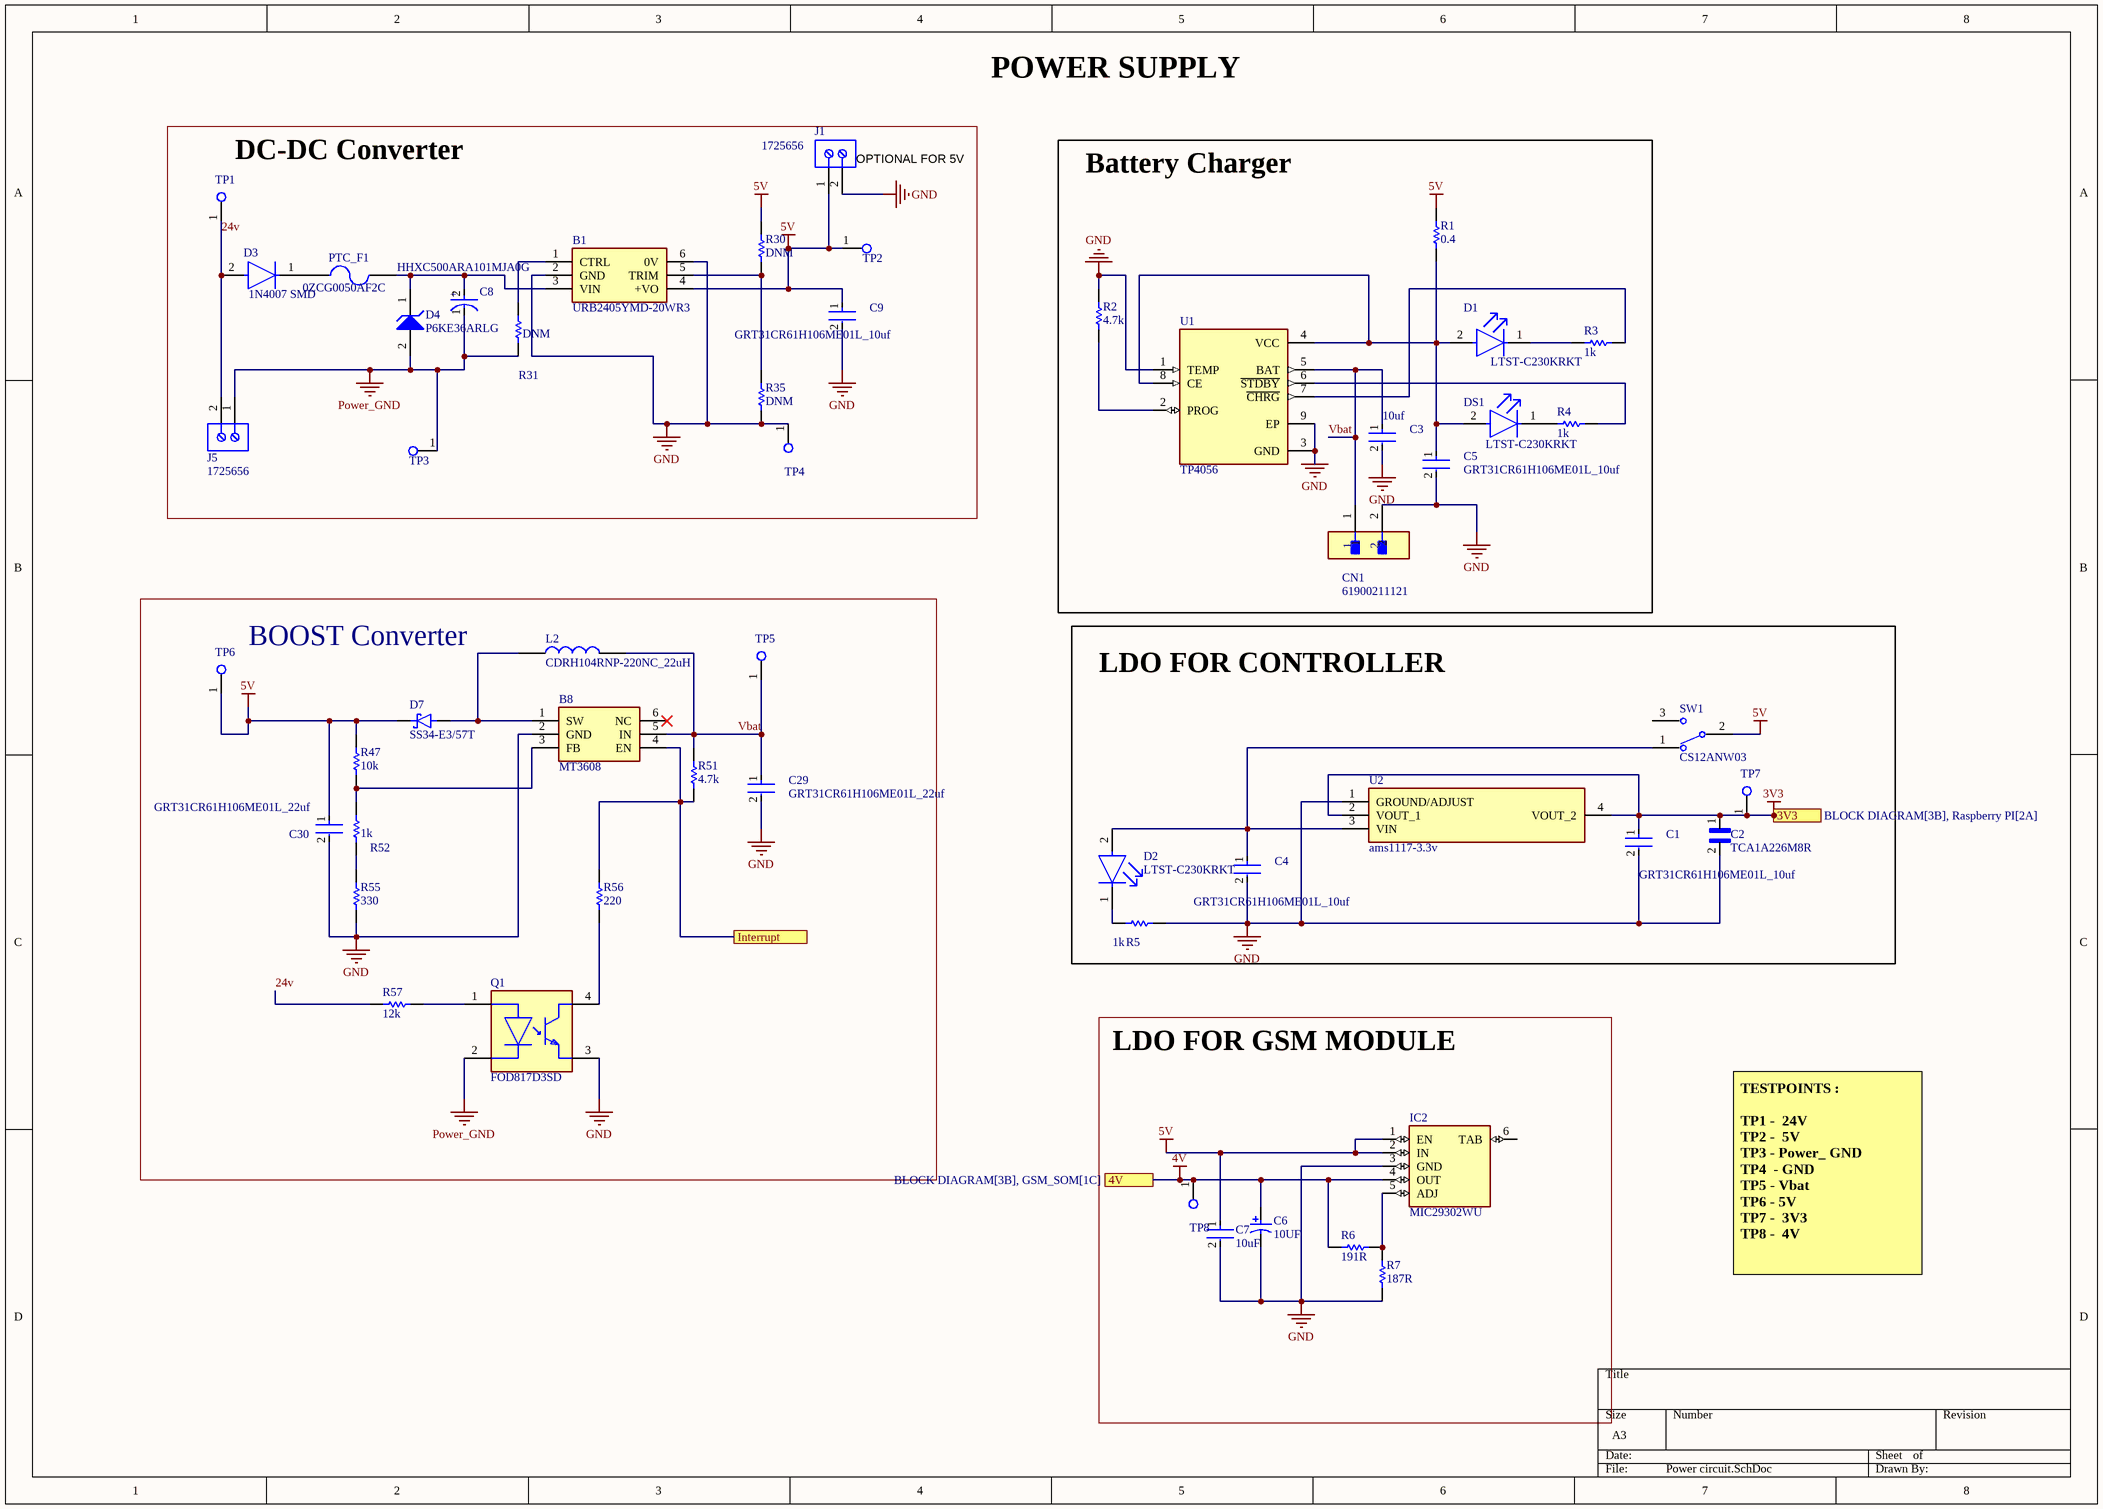
[diagram p5: Power circuit.SchDoc]

### Parts
B1  URB2405YMD-20WR3  [URB2405YMD20WR3]
B8  MT3608  [SOT95P280X145-6N]
C1  GRT31CR61H106ME01L_10uf  [FP-GRT31C-0_2-MFG]
C2  TCA1A226M8R  [RESC3216X65N]
C3  10uf  [FP-GRT31C-0_2-MFG]
C4  GRT31CR61H106ME01L_10uf  [FP-GRT31C-0_2-MFG]
C5  GRT31CR61H106ME01L_10uf  [FP-GRT31C-0_2-MFG]
C6  10UF  [KEMT-A-3216-18-2_M]
C7  10uF  [FP-CL05A106MP5NUNC-MFG]
C8  HHXC500ARA101MJA0G  [FP-HXC-ALA0-MFG]
C9  GRT31CR61H106ME01L_10uf  [FP-GRT31C-0_2-MFG]
C29  GRT31CR61H106ME01L_22uf  [FP-GRT31C-0_2-MFG]
C30  GRT31CR61H106ME01L_22uf  [FP-GRT31C-0_2-MFG]
CN1  61900211121  [FP-61900211121-MFG]
D1  LTST-C230KRKT  [FP-LTST-C230KRKT-MFG]
D2  LTST-C230KRKT  [FP-LTST-C230KRKT-MFG]
D3  1N4007 SMD  [FP-1N4007_SMD-IPC_C]
D4  P6KE36ARLG  [ONSC-SURMETIC40-2-017AA-01]
D7  SS34-E3/57T  [DIOM7959X262N]
DS1  LTST-C230KRKT  [FP-LTST-C230KRKT-MFG]
IC2  MIC29302WU  [MIC29302WU]
J1  1725656  [PHOE-1725656-2]
J5  1725656  [PHOE-1725656-2]
L2  CDRH104RNP-220NC_22uH  [INDPM102100X400N]
PTC_F1  0ZCG0050AF2C  [F1812]
Q1  FOD817D3SD  [FP-709AH-MFG]
R1  value 0.4  [RESC3216X60X45ML15T20]  (hidden comment: Resistor 0R +/- 5% 1206 250 mW)
R2  value 4.7k  [RESC3216X60X45ML15T20]  (hidden comment: Resistor 0R +/- 5% 1206 250 mW)
R3  value 1k  [RESC3216X60X45ML15T20]  (hidden comment: Resistor 0R +/- 5% 1206 250 mW)
R4  value 1k  [RESC3216X60X45ML15T20]  (hidden comment: Resistor 0R +/- 5% 1206 250 mW)
R5  value 1k  [RESC3216X60X45ML15T20]  (hidden comment: Resistor 0R +/- 5% 1206 250 mW)
R6  191R  [RESC1005X40X25ML05T05]
R7  187R  [RESC1005X35X20LL05T10]
R30  0: DNM  [RESC3216X60X45ML15T20]  (hidden comment: Resistor 0R +/- 5% 1206 250 mW)
R31  0: DNM  [RESC3216X60X45ML15T20]  (hidden comment: Resistor 0R +/- 5% 1206 250 mW)
R35  0: DNM  [RESC3216X60X45ML15T20]  (hidden comment: Resistor 0R +/- 5% 1206 250 mW)
R47  value 10k  [RESC3216X60X45ML15T20]  (hidden comment: RC1206JR-074K7L)
R51  value 4.7k  [RESC3216X60X45ML15T20]  (hidden comment: RC1206JR-074K7L)
R52  value 1k  [RESC3216X60X45ML15T20]  (hidden comment: RC1206JR-072KL)
R55  value 330  [RESC3216X60X45ML15T20]  (hidden comment: RC1206JR-0747KL)
R56  value 220  [RESC3216X60X45ML15T20]  (hidden comment: RC1206JR-07220RL)
R57  value 12k  [RESC3216X60X45ML15T20]  (hidden comment: RC1206JR-0712KL)
SW1  CS12ANW03  [FP-CS12ANW03-MFG]
TP1  Test Point  [TEST_POINT_SMD_30D]  (value not drawn)
TP2  Test Point  [TEST_POINT_SMD_30D]  (value not drawn)
TP3  Test Point  [TEST_POINT_SMD_30D]  (value not drawn)
TP4  Test Point  [TEST_POINT_SMD_30D]  (value not drawn)
TP5  Test Point  [TEST_POINT_SMD_30D]  (value not drawn)
TP6  Test Point  [TEST_POINT_SMD_30D]  (value not drawn)
TP7  Test Point  [TEST_POINT_SMD_30D]  (value not drawn)
TP8  Test Point  [TEST_POINT_SMD_30D]  (value not drawn)
U1  TP4056  [SOP127P600X175-9N]
U2  ams1117-3.3v  [SOT229P700X180-4N]

### Blocks framed on the sheet
DC-DC Converter: B1 C8 C9 D3 D4 J1 J5 PTC_F1 R30 R31 R35 TP1-TP4
Battery Charger: C3 C5 CN1 D1 DS1 R1-R4 U1
BOOST Converter: B8 C29 C30 D7 L2 Q1 R47 R51 R52 R55-R57 TP5 TP6
LDO FOR CONTROLLER: C1 C2 C4 D2 R5 SW1 TP7 U2
LDO FOR GSM MODULE: C6 C7 IC2 R6 R7 TP8

### Ports
3V3 (see BLOCK DIAGRAM[3B], Raspberry PI[2A]), 4V (see BLOCK DIAGRAM[3B], GSM_SOM[1C]), Interrupt

### Nets
3V3: C1.1 C2.1 TP7.1 U2.2(VOUT_1) U2.4(VOUT_2) ; port 3V3
4V: C6.1 IC2.4(OUT) R6.1 TP8.1 ; port 4V
5V: B1.4(+VO) C7.1 C9.1 C30.1 D7.C IC2.1(EN) IC2.2(IN) J1.1 R1.2 R30.2 R47.2 SW1.2(2(COM)) TP2.1 TP6.1
GND: B1.2(GND) B1.6(0V) B8.2(GND) C1.2 C2.2 C3.2 C4.2 C5.2 C6.2 C7.2 C9.2 C29.2 C30.2 CN1.2 IC2.3(GND) J1.2 Q1.3(E) R2.2 R5.1 R7.1 R35.1 R55.1 TP4.1 U1.1(TEMP) U1.3(GND) U1.9(EP) U2.1(GROUND/ADJUST)
Power_GND: C8.1(C) D4.2(A) J5.1 Q1.2(C) R31.1 TP3.1
24v: D3.2(A) J5.2 R57.2 TP1.1  [project net 24v_4]
Vbat: B8.5(IN) C3.1 C29.1 CN1.1 L2.2 R51.2 TP5.1 U1.5(BAT)  [project net Vbat_4]
NetB1_1: B1.1(CTRL) R31.2
NetB1_3: B1.3(VIN) C8.2(A) D4.1(K) PTC_F1.2
NetB1_5: B1.5(TRIM) R30.1 R35.2
NetB8_1: B8.1(SW) D7.A L2.1
NetB8_3: B8.3(FB) R47.1 R52.2
NetB8_4: B8.4(EN) R51.1 R56.2 ; port Interrupt
NetC4_1: C4.1 D2.2(A) SW1.1 U2.3(VIN)
NetC5_1: C5.1 D1.2(A) DS1.2(A) R1.1 U1.4(VCC) U1.8(CE)
NetD1_1: D1.1(C) R3.2
NetD2_1: D2.1(C) R5.2
NetD3_1: D3.1(C) PTC_F1.1
NetDS1_1: DS1.1(C) R4.2
NetIC2_5: IC2.5(ADJ) R6.2 R7.2
NetQ1_1: Q1.1(A) R57.1
NetQ1_4: Q1.4(C) R56.1
NetR2_1: R2.1 U1.2(PROG)
NetR3_1: R3.1 U1.7(~{CHRG})
NetR4_1: R4.1 U1.6(~{STDBY})
NetR52_1: R52.1 R55.2

Not connected (* = marked no-connect by the designer): B8 6(NC)*; IC2 6(TAB); SW1 3

### Notes on the sheet
- POWER SUPPLY
- (near J1) OPTIONAL FOR 5V
- TESTPOINTS :
  TP1 -  24V
  TP2 -  5V
  TP3 - Power_ GND
  TP4  - GND
  TP5 - Vbat
  TP6 - 5V
  TP7 -  3V3
  TP8 -  4V
- (in symbol CMP-33769-000007-1) +

### Library data of the parts
B1 = URB2405YMD-20WR3: 20W isolated DC-DC converter DIP package, Ultra-wide input and regulated single output; Manufacturer_Name: Mornsun Power; Geometry.Height: 12.2mm; Manufacturer_Part_Number: URB2405YMD-20WR3; Mouser Part Number: *; Mouser Price/Stock: *; Arrow Part Number: *; Arrow Price/Stock: *; Datasheet Link: https://4donline.ihs.com/images/VipMasterIC/IC/MNSN/MNSN-S-A0014923150/MNSN-S-A0014923730-1.pdf?hkey=EF798316E3902B6ED9A73243A3159BB0
B8 = MT3608: High Efficiency 1.2MHz 2A Step Up Converter; Manufacturer_Name: Aerosemi; Geometry.Height: 1.45mm; Manufacturer_Part_Number: MT3608; Mouser Part Number: *; Mouser Price/Stock: *; Arrow Part Number: *; Arrow Price/Stock: *; Datasheet Link: https://www.olimex.com/Products/Breadboarding/BB-PWR-3608/resources/MT3608.pdf
C1 C3-C5 C9 C29 C30 = CMP-06035-048951-1: CAP CER 10UF 50V X5R 1206; Tolerance: 20%; Length: 0.126inch; Mount: Surface Mount; Packaging: Tape and Reel; Capacitance: 10uF; Case/Package: 1206; Case Code (Imperial): 1206; Max Operating Temperature: 85°C; Voltage Rating: 50V; Ratings: AEC-Q200; Min Operating Temperature: -55°C; Thickness: 0.071inch; Width: 0.063inch; Case Code (Metric): 3216
C2 = TCA1A226M8R: 22ÂµF Molded Tantalum Capacitors 10V 1206 (3216 Metric); MF: Rohm; Price: None; Availability: Unavailable; SnapEDA_Link: https://www.snapeda.com/parts/TCA1A226M8R/Rohm/view-part/1738219/?ref=snap; Value: *; Package: 1206 Rohm; MP: TCA1A226M8R
C6 = CMP-2000-05172-1: Capacitor, Tantalum, 10 uF, +/- 10%, 10 V, -55 to 125 degC, 2-Pin SMD (1206), RoHS, Tape and Reel; Manufacturer Size Code: A; Manufacturer: Kemet; Type: Molded; Online Catalog: T491Series; Other Names: 399-3684-2; Voltage - Rated: 10V; Lifetime @ Temp.: 2000Hrs@85degC; Product Training Modules: CapacitorBasics-TypicalUsesforCapacitorsDeratingGuidelinesforSurfaceMountTantalumCapacitors; ESR (Equivalent Series Resistance): 3.8Ohm; Capacitance: 10µF; Catalog Drawings: T49x,T5xxSeries_A-side1T49x,T5xxSeries_A,B-side2T49x,T5xxSeries_A,SBottom; Family: TantalumCapacitors; Manufacturer URL: http://www.kemet.com/; Datasheet URL: http://www.farnell.com/datasheets/1824869.pdf; Package Reference: 1206; Packaging: Tape&Reel(TR); Series: T491; Operating Temperature: -55degC~125degC; Mounting Type: SurfaceMount; Height - Seated (Max): 0.071"(1.80mm); Package / Case: 1206(3216Metric); Package Description: 2-Pin Surface Mount Device, Body 3.2 x 1.6 mm; Features: GeneralPurpose; Tolerance: ±10%; Lead Spacing: -; Size / Dimension: 0.126"Lx0.063"W(3.20mmx1.60mm); Standard Package: 2,000; Datasheet Version: Apr-14; Category: Capacitors
C7 = CMP-13271-000002-1: CAP CER 10UF 10V X5R 0402; Manufacturer Part Number: CL05A106MP5NUNC; Manufacturer: Samsung; Temperature Coefficient: 15%; Tolerance: 20%; Material: Ceramic; Octopart: https://octopart.com/cl05a106mp5nunc-samsung-22457395; Voltage Rating: 10V; RoHS: TRUE; Value: 10uF; Height: 0.7mm; Digikey Description: CAP CER 10UF 10V X5R 0402; Automotive: No; Package: CL05A106MP5NUNC; Device Class L1: Passive Components; Capacitance: 10uF; Temperature Range High: +85°C; ComponentLink2Description: Datasheet; Device Class L2: Capacitors; Temperature Characteristic: X5R; Temperature: -55°C to +85°C; ComponentLink2URL: http://www.samsungsem.com/kr/support/product-search/mlcc/__icsFiles/afieldfile/2019/05/10/19-CL05A106MP5NUNC.pdf; Device Class L3: Ceramic Capacitors; Category: Cap; Temperature Range Low: -55°C; Ipc Land Pattern Name: CAPC10050X50; Lead Free: Yes
C8 = CMP-33769-000007-1: CAP ALUM POLY 100UF 20% 50V SMD; Life (Hours): 4000Hour; ESR (Equivalent Series Resistance): 25mR; Packaging: Cut Tape; Case/Package: Radial; Capacitance: 100uF; Resistor Type: Hybrid; Max Operating Temperature: 125°C; Voltage Rating: 50V; Min Operating Temperature: -55°C; RoHS Compliant: Yes; Tolerance: 20%; Ratings: AEC-Q200; Mount: Surface Mount
CN1 = CMP-1502-00584-2: CONN HEADER VERT 2POS 2.54MM; Number of Contacts: 2; Gender: Male; Current Rating: 3A; Voltage Rating: 250V; Insulation Resistance: 1GR; Contact Material: Copper Alloy; Package Quantity: 1000; Color: Beige; Mount: Through Hole; Termination: Through Hole; Fastening Type: Friction; Contact Mating Length: 0.295inch; Pitch: 2.54mm; Max Operating Temperature: 105°C; Height: 14.2mm; RoHS Compliant: Yes; Packaging: Bulk; Contact Type: Male Pin; Width: 5.12mm; Housing Material: Nylon; Min Operating Temperature: -40°C; Insulation Material: Nylon; Contact Finish - Mating: TIN; Insulation Color: Beige; Contact Plating: Tin; Flammability Rating: UL94 V-0; Length: 5.8mm; Contact Gender: Male; Connector Type: Header; Contact Shape: Square; Series: WR-WTB; Number of Positions: 2; Number of Rows: 1
D1 D2 DS1 = CMP-22017-000041-1: LED RED CLEAR CHIP SMD; Dominant Wavelength: 631nm; Lens Color: Colorless; Lens Style: Diffused; Forward Voltage: 2V; Test Current: 20mA; Luminous Intensity: 54mcd; Number of LEDs: 1; Viewing Angle: 130°; Power Rating: 75mW; Forward Current: 30mA; Wavelength: 639nm; Reverse Voltage: 5V; Min Operating Temperature: -55°C; Height: 1.1mm; Length: 3.2mm; Lens Transparency: Clear; Case/Package: 1206; Package Quantity: 1; Width: 1.6mm; Max Operating Temperature: 85°C; Packaging: Tape and Reel; RoHS Compliant: Yes; Mount: Surface Mount; Lead Free: Lead Free; Depth: 1.6mm; Power Dissipation: 75mW; Number of Pins: 2; Number of Elements: 1; Color: Red; Illumination Color: Red; Case Code (Imperial): 1206; Case Code (Metric): 3216; Radiation Hardening: No
D3 = CMP-12389-000001-1: Rectifier, 1Kv, 1A, Do-214Ac Rohs Compliant: Yes
D4 = CMP-1061-00690-1: 600 W Peak Power Transient Voltage Suppressor, 2-Pin Surmetic(TM) 40, Pb-Free, Tape and Reel; Manufacturer: On Semiconductor; V(BR) Typ (V): 36; PPK Max (W): 600; IR Max (uA): 5; Direction: Unidirectional; Packing: Tape and Reel; PackageReference: SURMETIC40-2-017AA-01; ComponentLink1Description: Manufacturer URL; ComponentLink3Description: Package Specification; RoHS: Pb-Free; ComponentLink2Description: Datasheet; PackageDescription: 2-Pin, Axial Lead, Diameter 3.49 mm; ComponentLink2URL: http://www.onsemi.com/pub_link/Collateral/P6KE6.8A-D.PDF; Mounting Technology: Through Hole; ComponentLink1URL: http://www.onsemi.com/; PartNumber: P6KE36ARLG; ComponentLink3URL: http://www.onsemi.cn/pub_link/Collateral/017AA.PDF; PackageVersion: Rev. O, 09/2005; DatasheetVersion: Rev. 10
D7 = SS34-E3/57T: Diode Schottky 40 V 3A Surface Mount DO-214AB (SMC); MF: Vishay General Semiconductor; SnapEDA_Link: https://www.snapeda.com/parts/SS34-E3/57T/General+Semiconductor/view-part/?ref=snap; Availability: In Stock; Check_prices: https://www.snapeda.com/parts/SS34-E3/57T/General+Semiconductor/view-part/?ref=eda; Value: *; Package: None; Purchase-URL: https://pricing.snapeda.com/search/part/SS34-E3/57T/?ref=eda; MP: SS34-E3/57T; Price: None
IC2 = MIC29302WU: Linear Voltage Regulator IC Positive Adjustable 1 Output 3A TO-263-5; MF: Microchip Technology; SnapEDA_Link: https://www.snapeda.com/parts/MIC29302WU/Microchip/view-part/?ref=snap; Package: TO-263-6 Microchip Technology / Micrel; Value: *; MP: MIC29302WU; Check_prices: https://www.snapeda.com/parts/MIC29302WU/Microchip/view-part/?ref=eda
J1 J5 = CMP-2000-05299-1: Male Header, Pitch 2.54 mm, 1 x 2 Position, Height 9 mm, Tail Length 3.5 mm; Manufacturer: Phoenix Contact; Number of contacts: 2; Content: 250pc(s); Pitch: 2.54mm; Industrial packaging: Yes; Colour: Green; Manufacturer part No.: 1725656; Type: MPT0,5/2-2,54; Datasheet URL: http://datasheet.octopart.com/1725656-Phoenix-Contact-datasheet-5302866.pdf; Manufacturer URL: http://www.phoenixcontact.com/; Datasheet Version: Apr-08
L2 = CDRH104RNP-220NC: Fixed Inductors 22uH 2.5A; Manufacturer_Name: Sumida; Geometry.Height: 4mm; Manufacturer_Part_Number: CDRH104RNP-220NC; Mouser Part Number: 851-CDRH104RNP-220NC; Mouser Price/Stock: https://www.mouser.co.uk/ProductDetail/Sumida/CDRH104RNP-220NC?qs=iXFGfj0UVr7lF4yqUlpBKQ%3D%3D; Arrow Part Number: CDRH104RNP-220NC; Arrow Price/Stock: https://www.arrow.com/en/products/cdrh104rnp-220nc/sumida?region=nac; Datasheet Link: http://products.sumida.com/products/pdf/CDRH104R.pdf
PTC_F1 = Fuse 2: PTC RESET FUSE 30V 500MA 1812; MFG: Bel Fuse Inc.; ASSEMBLY_TYPE: SMT; MACRO: Power Management; MFG_PN: 0ZCG0050AF2C; PACKAGE: SMT; NOTE: *; KHK_AN: *
Q1 = CMP-07144-000021-1: OPTOISOLATOR 5KV TRANSISTOR 4SMD; Manufacturer: ON Semiconductor; Isolation Voltage: 5000Vrms; Reverse Voltage: 6V; Max Junction Temp: +125°C; Forward Current: 20mA; Collector Emitter Voltage: 70V; Forward Voltage: 1.2V; Min Current Transfer Ratio: 300%; Power Dissipation: 200mW; Max Current Transfer Ratio: 600%; Standoff Height: 0.35mm; Temperature: -55°C to +110°C; Category: Trans; ComponentLink2URL: https://www.onsemi.com/pub/Collateral/FOD814-D.PDF; Lead Free: Yes; ComponentLink2Description: Datasheet; Automotive: No; Mouser Description: Transistor Output Optocouplers Phototransistor Output; Octopart: https://octopart.com/fod817d3sd-on+semiconductor-84327552; Device Class L1: Optoelectronics; Height: 4.35mm; Device Class L2: Optocouplers; Device Class L3: unset; Manufacturer Part Number: FOD817D3SD; Temperature Range High: +110°C; Digikey Description: OPTOISOLATOR 5KV TRANSISTOR 4SMD; Footprint Url: https://www.onsemi.com/pub/Collateral/709AH.PDF; Temperature Range Low: -55°C; RoHS: TRUE; Package: 709AH; Emiiter Collector Voltage: 6V
R1-R5 R30 R31 R35 R47 R51 R52 R55-R57 = CMP-009-00002-5: as R27 on sheet Optocoupler; Tolerance: 5%; Min Operating Temperature: -55°C; Mounting Technology: SM; Max Operating Temperature: 155°C; Case/Package: 1206; RoHS Compliant: True; Pins: 2
R6 = CMP-1011-00427-2: Manufacturer: Panasonic; Part Number: ERJ-2RKF1910X
R7 = CMP-2002-03161-1: Part Number: CPF0402B187RE1; Manufacturer: TE Connectivity / AMP
SW1 = CMP-31746-000002-1: SWITCH SLIDE SPDT 3A 125V; Max Voltage Rating (AC): 250V; Mechanical Life: 50000Cycles; Switch Travel: 2.2mm; Electrical Life: 20000Cycles; Actuator Length: 5.1mm; Illumination Type: Non-Illuminated; Contact Style: Non-Shorting; Actuator Type: Standard; Actuator Material: Nylon; Switch Function: On-On; Max Operating Temperature: 85°C; Series: CS; Contact Current Rating: 3A; Min Operating Temperature: -30°C; Current Rating: 3A; Mount: Through Hole; Depth: 7.5mm; RoHS Compliant: Yes; Throw Configuration: SPDT; Lead Free: Lead Free; Orientation: Vertical; Contact Plating: Silver; Reach SVHC Compliant: Yes; Termination: PC Pin; Max Current Rating: 3A; Packaging: Tray; Length: 14mm; Package Quantity: 1; Primary Type: SWITCH; Flammability Rating: UL94 V-0; Contact Material: Copper; Voltage Rating (AC): 125V
TP1-TP8 = TP: TEST POINT PC MINI .040"D RED; MFG: Keystone; MFG_PN: 5000; ASSEMBLY_TYPE: TH; MACRO: Power Management (VYS, 5V, 3.3V and Reset); PACKAGE: Assembly; TEMPERATURE: -55°C ~ 155°C
U1 = TP4056: Complete single cell Li-Ion battery with a constant current / constant voltage linear charger; MF: NanJing Top Power ASIC Corp.; Check_prices: https://www.snapeda.com/parts/TP4056/NanJing+Top+Power+ASIC+Corp./view-part/?ref=eda; SnapEDA_Link: https://www.snapeda.com/parts/TP4056/NanJing+Top+Power+ASIC+Corp./view-part/?ref=snap; Price: None; Availability: Not in stock; Package: Package; MP: TP4056; Value: *
U2 = ams1117-3.3v: 1A LOW DROPOUT VOLTAGE REGULATOR, SOT-223; Manufacturer_Name: Advanced Monolithic Systems; Geometry.Height: 1.8mm; Manufacturer_Part_Number: ams1117-3.3v; Mouser Part Number: *; Mouser Price/Stock: *; Arrow Part Number: *; Arrow Price/Stock: *; Datasheet Link: http://www.advanced-monolithic.com/pdf/ds1117.pdf